# EAGLE design module_decoding_a (EAGLE 6.5.0)

## Sheet 1 of 13
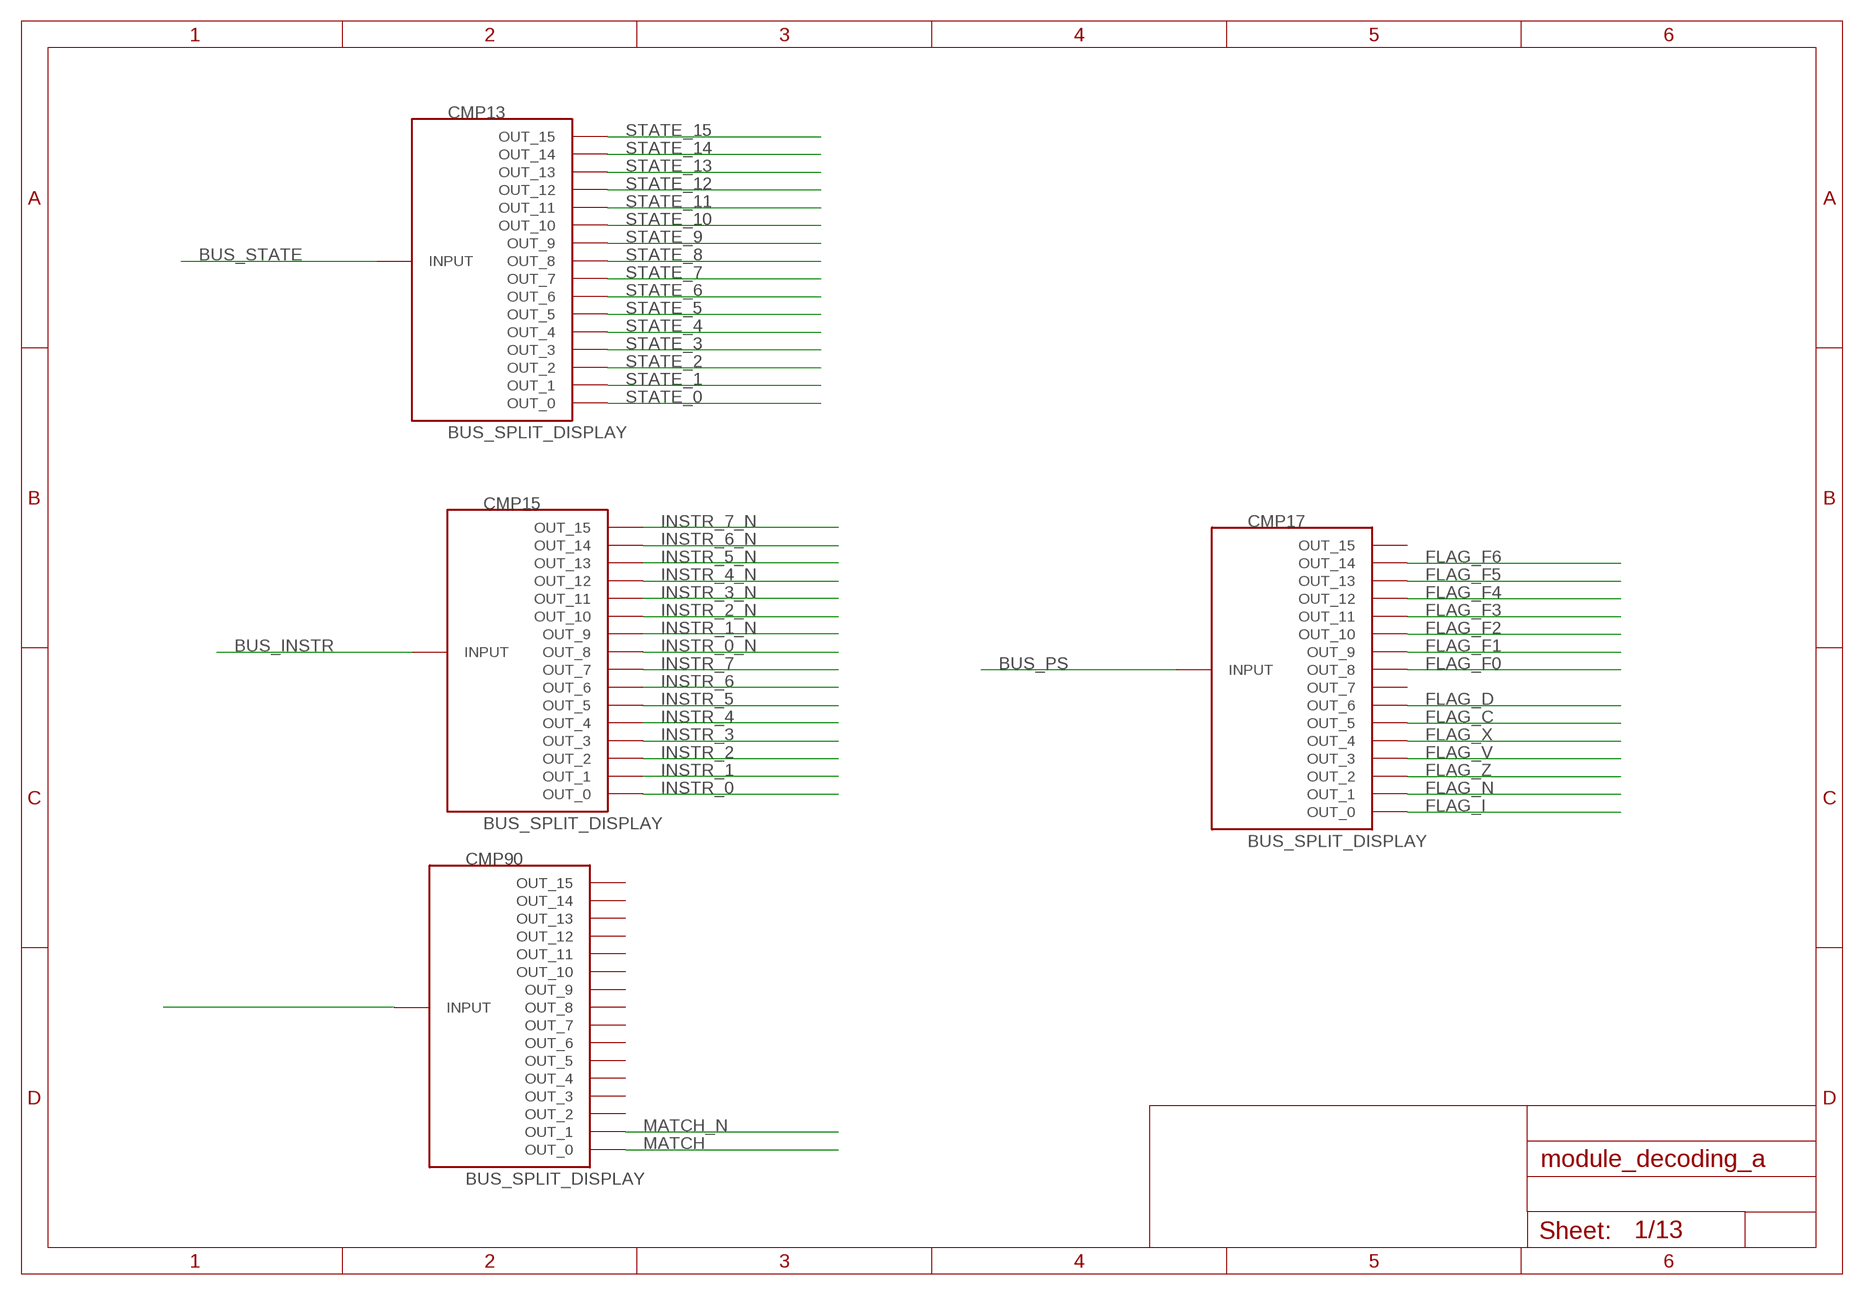
[diagram p0: schematic, sheet 1]

### Parts
CMP13  BUS_SPLIT_DISPLAY  [BUS_SPLIT_DISPLAY]
CMP15  BUS_SPLIT_DISPLAY  [BUS_SPLIT_DISPLAY]
CMP17  BUS_SPLIT_DISPLAY  [BUS_SPLIT_DISPLAY]
CMP90  BUS_SPLIT_DISPLAY  [BUS_SPLIT_DISPLAY]

### Nets
BUS_INSTR: CMP15.INPUT
BUS_PS: CMP17.INPUT
BUS_STATE: CMP13.INPUT
FLAG_C: CMP17.P$6(OUT_5)
FLAG_D: CMP17.P$7(OUT_6)
FLAG_F0: CMP17.P$9(OUT_8)
FLAG_F1: CMP17.P$10(OUT_9)
FLAG_F2: CMP17.P$11(OUT_10) ; also sheet 11
FLAG_F3: CMP17.P$12(OUT_11)
FLAG_F4: CMP17.P$13(OUT_12) ; also sheet 10
FLAG_F5: CMP17.P$14(OUT_13) ; also sheet 10
FLAG_F6: CMP17.P$15(OUT_14)
FLAG_I: CMP17.P$1(OUT_0)
FLAG_N: CMP17.P$2(OUT_1)
FLAG_V: CMP17.P$4(OUT_3)
FLAG_X: CMP17.P$5(OUT_4)
FLAG_Z: CMP17.P$3(OUT_2)
INSTR_0: CMP15.P$1(OUT_0) ; also sheet 13
INSTR_0_N: CMP15.P$9(OUT_8) ; also sheet 7
INSTR_1: CMP15.P$2(OUT_1)
INSTR_1_N: CMP15.P$10(OUT_9)
INSTR_2: CMP15.P$3(OUT_2) ; also sheet 5,12
INSTR_2_N: CMP15.P$11(OUT_10) ; also sheet 7
INSTR_3: CMP15.P$4(OUT_3) ; also sheet 5
INSTR_3_N: CMP15.P$12(OUT_11)
INSTR_4: CMP15.P$5(OUT_4)
INSTR_4_N: CMP15.P$13(OUT_12)
INSTR_5: CMP15.P$6(OUT_5)
INSTR_5_N: CMP15.P$14(OUT_13)
INSTR_6: CMP15.P$7(OUT_6)
INSTR_6_N: CMP15.P$15(OUT_14)
INSTR_7: CMP15.P$8(OUT_7)
INSTR_7_N: CMP15.P$16(OUT_15)
MATCH: CMP90.P$1(OUT_0) ; also sheet 8
MATCH_N: CMP90.P$2(OUT_1) ; also sheet 8
N$27: CMP90.INPUT
STATE_0: CMP13.P$1(OUT_0) ; also sheet 6,7,8
STATE_1: CMP13.P$2(OUT_1) ; also sheet 7
STATE_2: CMP13.P$3(OUT_2) ; also sheet 6
STATE_3: CMP13.P$4(OUT_3)
STATE_4: CMP13.P$5(OUT_4)
STATE_5: CMP13.P$6(OUT_5)
STATE_6: CMP13.P$7(OUT_6) ; also sheet 7
STATE_7: CMP13.P$8(OUT_7) ; also sheet 6
STATE_8: CMP13.P$9(OUT_8)
STATE_9: CMP13.P$10(OUT_9)
STATE_10: CMP13.P$11(OUT_10)
STATE_11: CMP13.P$12(OUT_11)
STATE_12: CMP13.P$13(OUT_12)
STATE_13: CMP13.P$14(OUT_13)
STATE_14: CMP13.P$15(OUT_14)
STATE_15: CMP13.P$16(OUT_15) ; also sheet 7
Unconnected: CMP17.P$8(OUT_7) CMP17.P$16(OUT_15) CMP90.P$3(OUT_2) CMP90.P$4(OUT_3) CMP90.P$5(OUT_4) CMP90.P$6(OUT_5) CMP90.P$7(OUT_6) CMP90.P$8(OUT_7) CMP90.P$9(OUT_8) CMP90.P$10(OUT_9) CMP90.P$11(OUT_10) CMP90.P$12(OUT_11) CMP90.P$13(OUT_12) CMP90.P$14(OUT_13) CMP90.P$15(OUT_14) CMP90.P$16(OUT_15)

## Sheet 2 of 13
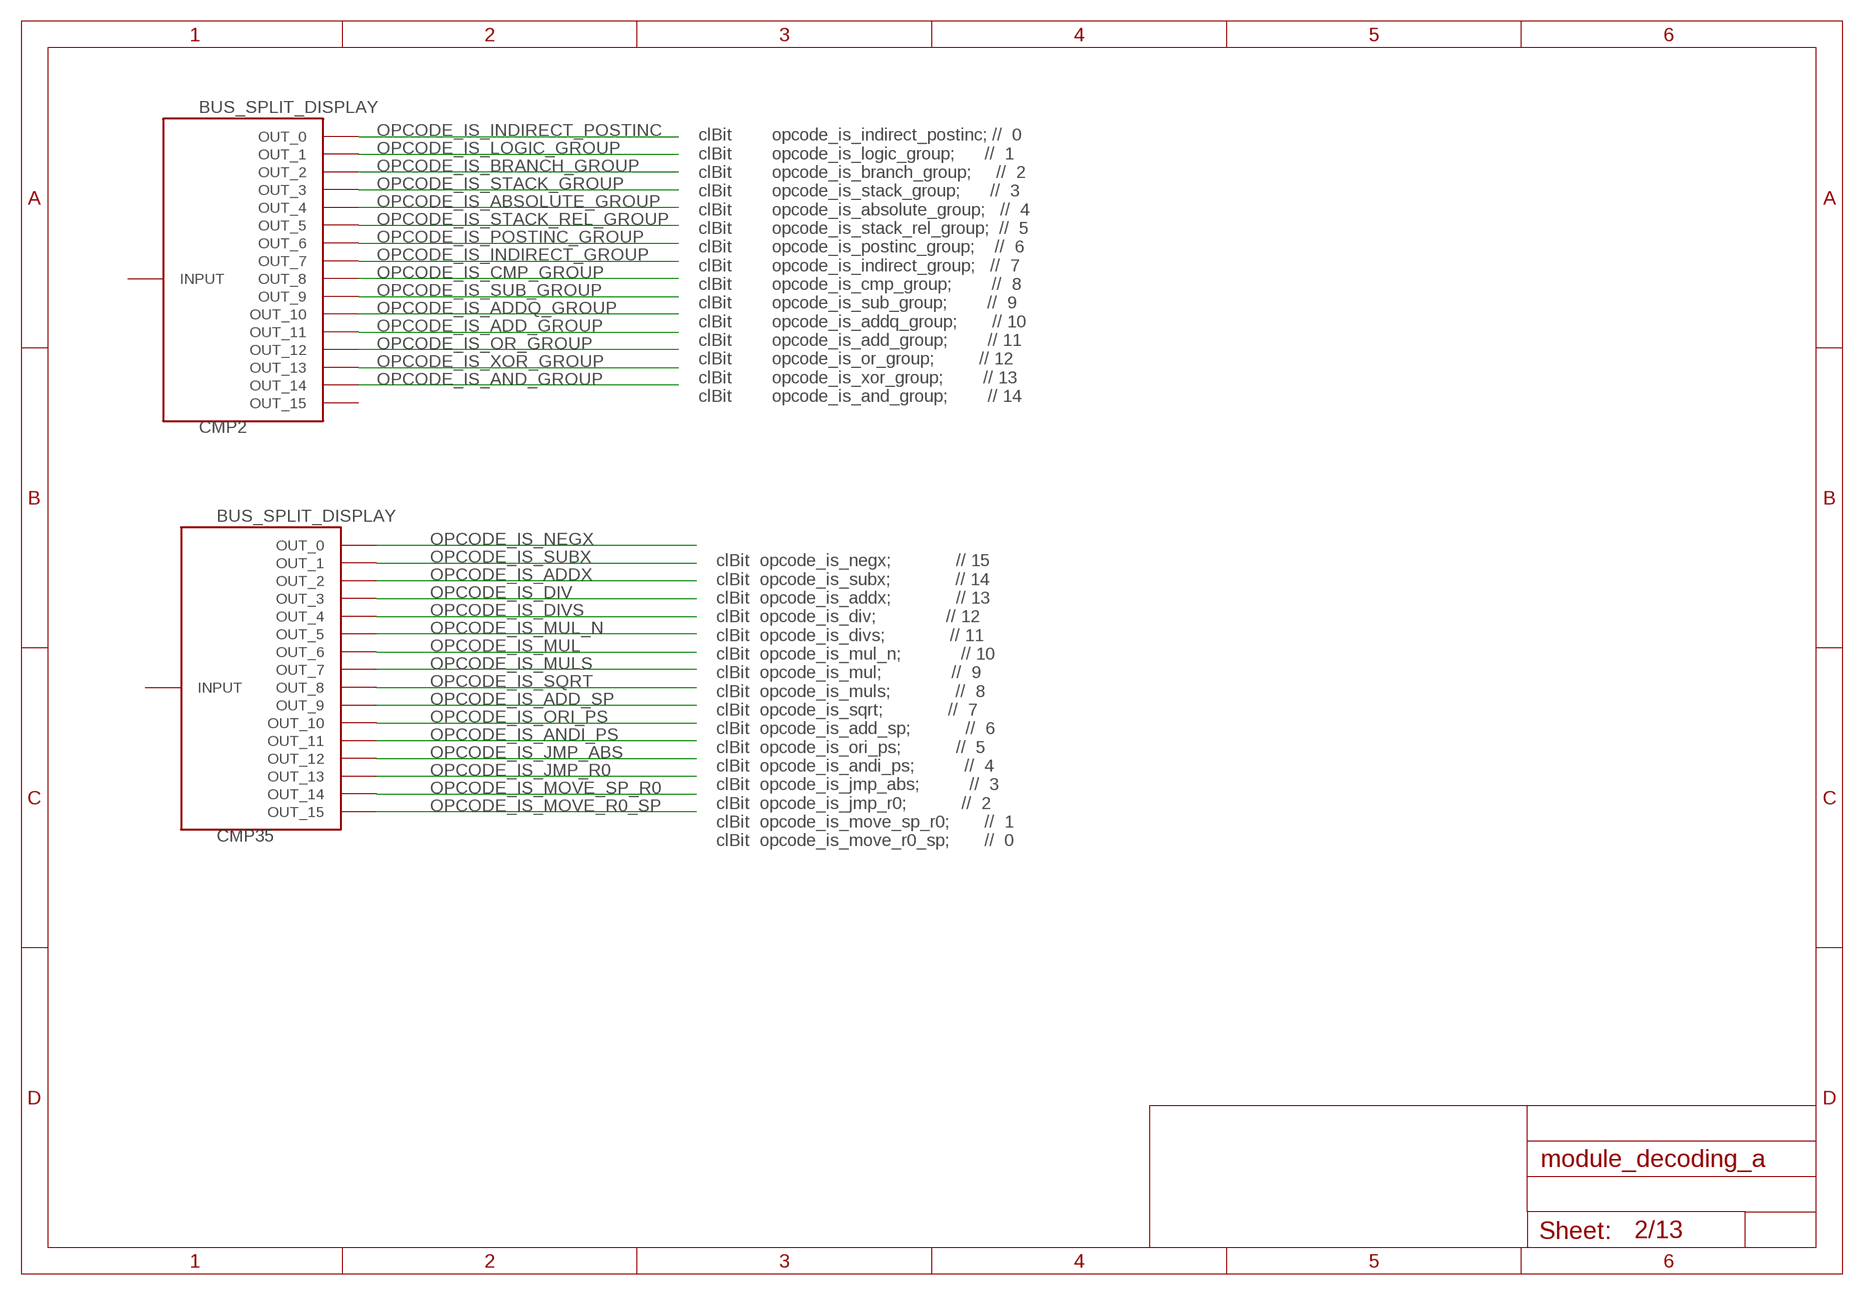
[diagram p1: schematic, sheet 2]

### Parts
CMP2  BUS_SPLIT_DISPLAY  [BUS_SPLIT_DISPLAY]
CMP35  BUS_SPLIT_DISPLAY  [BUS_SPLIT_DISPLAY]

### Nets
OPCODE_IS_ABSOLUTE_GROUP: CMP2.P$5(OUT_4) ; also sheet 7,12,13
OPCODE_IS_ADD_GROUP: CMP2.P$12(OUT_11)
OPCODE_IS_ADD_SP: CMP35.P$10(OUT_9) ; also sheet 6,12,13
OPCODE_IS_ADDQ_GROUP: CMP2.P$11(OUT_10)
OPCODE_IS_ADDX: CMP35.P$3(OUT_2)
OPCODE_IS_AND_GROUP: CMP2.P$15(OUT_14)
OPCODE_IS_ANDI_PS: CMP35.P$12(OUT_11) ; also sheet 8,9
OPCODE_IS_BRANCH_GROUP: CMP2.P$3(OUT_2) ; also sheet 6,8,12,13
OPCODE_IS_CMP_GROUP: CMP2.P$9(OUT_8)
OPCODE_IS_DIV: CMP35.P$4(OUT_3) ; also sheet 6
OPCODE_IS_DIVS: CMP35.P$5(OUT_4)
OPCODE_IS_INDIRECT_GROUP: CMP2.P$8(OUT_7)
OPCODE_IS_INDIRECT_POSTINC: CMP2.P$1(OUT_0) ; also sheet 12
OPCODE_IS_JMP_ABS: CMP35.P$13(OUT_12) ; also sheet 12,13
OPCODE_IS_JMP_R0: CMP35.P$14(OUT_13) ; also sheet 12,13
OPCODE_IS_LOGIC_GROUP: CMP2.P$2(OUT_1)
OPCODE_IS_MOVE_R0_SP: CMP35.P$16(OUT_15) ; also sheet 8
OPCODE_IS_MOVE_SP_R0: CMP35.P$15(OUT_14) ; also sheet 8,12
OPCODE_IS_MUL: CMP35.P$7(OUT_6) ; also sheet 13
OPCODE_IS_MUL_N: CMP35.P$6(OUT_5)
OPCODE_IS_MULS: CMP35.P$8(OUT_7)
OPCODE_IS_NEGX: CMP35.P$1(OUT_0)
OPCODE_IS_OR_GROUP: CMP2.P$13(OUT_12)
OPCODE_IS_ORI_PS: CMP35.P$11(OUT_10) ; also sheet 8,9
OPCODE_IS_POSTINC_GROUP: CMP2.P$7(OUT_6)
OPCODE_IS_SQRT: CMP35.P$9(OUT_8) ; also sheet 13
OPCODE_IS_STACK_GROUP: CMP2.P$4(OUT_3) ; also sheet 12
OPCODE_IS_STACK_REL_GROUP: CMP2.P$6(OUT_5) ; also sheet 6,12,13
OPCODE_IS_SUB_GROUP: CMP2.P$10(OUT_9)
OPCODE_IS_SUBX: CMP35.P$2(OUT_1)
OPCODE_IS_XOR_GROUP: CMP2.P$14(OUT_13)
Unconnected: CMP2.INPUT CMP2.P$16(OUT_15) CMP35.INPUT

### Notes on the sheet
- clBit        opcode_is_indirect_postinc; //  0
      clBit        opcode_is_logic_group;      //  1
      clBit        opcode_is_branch_group;     //  2
      clBit        opcode_is_stack_group;      //  3
      clBit        opcode_is_absolute_group;   //  4
      clBit        opcode_is_stack_rel_group;  //  5
      clBit        opcode_is_postinc_group;    //  6
      clBit        opcode_is_indirect_group;   //  7
      clBit        opcode_is_cmp_group;        //  8
      clBit        opcode_is_sub_group;        //  9
      clBit        opcode_is_addq_group;       // 10
      clBit        opcode_is_add_group;        // 11
      clBit        opcode_is_or_group;         // 12
      clBit        opcode_is_xor_group;        // 13
      clBit        opcode_is_and_group;        // 14
- clBit  opcode_is_negx;             // 15
      clBit  opcode_is_subx;             // 14
      clBit  opcode_is_addx;             // 13
      clBit  opcode_is_div;              // 12
      clBit  opcode_is_divs;             // 11
      clBit  opcode_is_mul_n;            // 10
      clBit  opcode_is_mul;              //  9
      clBit  opcode_is_muls;             //  8
      clBit  opcode_is_sqrt;             //  7
      clBit  opcode_is_add_sp;           //  6
      clBit  opcode_is_ori_ps;           //  5
      clBit  opcode_is_andi_ps;          //  4
      clBit  opcode_is_jmp_abs;          //  3
      clBit  opcode_is_jmp_r0;           //  2
      clBit  opcode_is_move_sp_r0;       //  1
      clBit  opcode_is_move_r0_sp;       //  0

## Sheet 3 of 13
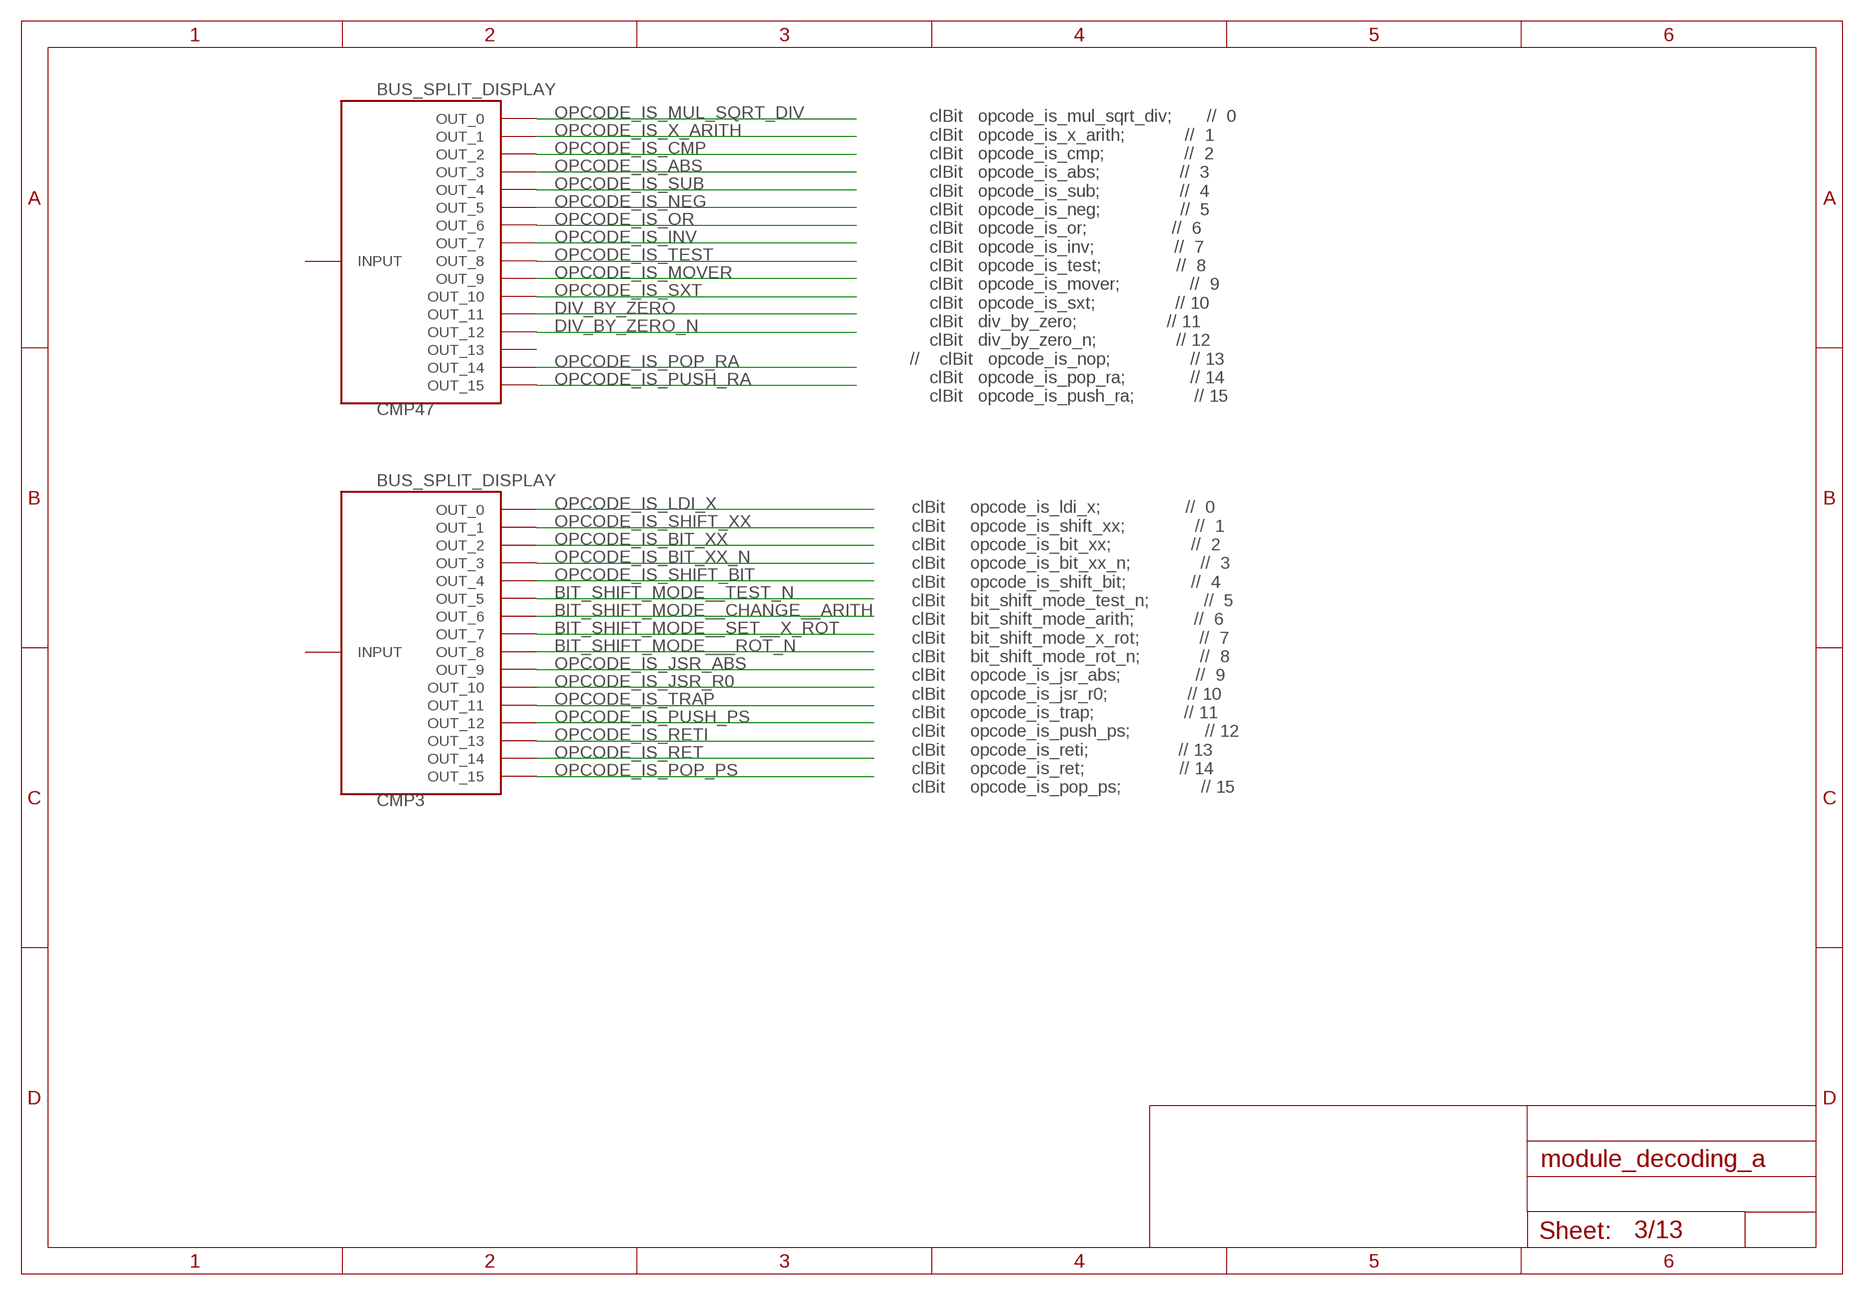
[diagram p2: schematic, sheet 3]

### Parts
CMP3  BUS_SPLIT_DISPLAY  [BUS_SPLIT_DISPLAY]
CMP47  BUS_SPLIT_DISPLAY  [BUS_SPLIT_DISPLAY]

### Nets
BIT_SHIFT_MODE___ROT_N: CMP3.P$9(OUT_8)
BIT_SHIFT_MODE__CHANGE__ARITH: CMP3.P$7(OUT_6)
BIT_SHIFT_MODE__SET__X_ROT: CMP3.P$8(OUT_7)
BIT_SHIFT_MODE__TEST_N: CMP3.P$6(OUT_5)
DIV_BY_ZERO: CMP47.P$12(OUT_11) ; also sheet 10,13
DIV_BY_ZERO_N: CMP47.P$13(OUT_12)
OPCODE_IS_ABS: CMP47.P$4(OUT_3)
OPCODE_IS_BIT_XX: CMP3.P$3(OUT_2) ; also sheet 13
OPCODE_IS_BIT_XX_N: CMP3.P$4(OUT_3)
OPCODE_IS_CMP: CMP47.P$3(OUT_2)
OPCODE_IS_INV: CMP47.P$8(OUT_7)
OPCODE_IS_JSR_ABS: CMP3.P$10(OUT_9) ; also sheet 12,13
OPCODE_IS_JSR_R0: CMP3.P$11(OUT_10) ; also sheet 7,12
OPCODE_IS_LDI_X: CMP3.P$1(OUT_0) ; also sheet 7,9
OPCODE_IS_MOVER: CMP47.P$10(OUT_9)
OPCODE_IS_MUL_SQRT_DIV: CMP47.P$1(OUT_0) ; also sheet 12
OPCODE_IS_NEG: CMP47.P$6(OUT_5)
OPCODE_IS_OR: CMP47.P$7(OUT_6)
OPCODE_IS_POP_PS: CMP3.P$16(OUT_15) ; also sheet 8
OPCODE_IS_POP_RA: CMP47.P$15(OUT_14) ; also sheet 8
OPCODE_IS_PUSH_PS: CMP3.P$13(OUT_12) ; also sheet 12
OPCODE_IS_PUSH_RA: CMP47.P$16(OUT_15) ; also sheet 12
OPCODE_IS_RET: CMP3.P$15(OUT_14) ; also sheet 8,13
OPCODE_IS_RETI: CMP3.P$14(OUT_13) ; also sheet 8,13
OPCODE_IS_SHIFT_BIT: CMP3.P$5(OUT_4) ; also sheet 12
OPCODE_IS_SHIFT_XX: CMP3.P$2(OUT_1) ; also sheet 9,12,13
OPCODE_IS_SUB: CMP47.P$5(OUT_4)
OPCODE_IS_SXT: CMP47.P$11(OUT_10)
OPCODE_IS_TEST: CMP47.P$9(OUT_8)
OPCODE_IS_TRAP: CMP3.P$12(OUT_11) ; also sheet 12,13
OPCODE_IS_X_ARITH: CMP47.P$2(OUT_1)
Unconnected: CMP3.INPUT CMP47.INPUT CMP47.P$14(OUT_13)

### Notes on the sheet
- clBit   opcode_is_mul_sqrt_div;       //  0
      clBit   opcode_is_x_arith;            //  1
      clBit   opcode_is_cmp;                //  2
      clBit   opcode_is_abs;                //  3
      clBit   opcode_is_sub;                //  4
      clBit   opcode_is_neg;                //  5
      clBit   opcode_is_or;                 //  6
      clBit   opcode_is_inv;                //  7
      clBit   opcode_is_test;               //  8
      clBit   opcode_is_mover;              //  9
      clBit   opcode_is_sxt;                // 10
      clBit   div_by_zero;                  // 11
      clBit   div_by_zero_n;                // 12
  //    clBit   opcode_is_nop;                // 13
      clBit   opcode_is_pop_ra;             // 14
      clBit   opcode_is_push_ra;            // 15
- clBit     opcode_is_ldi_x;                 //  0
      clBit     opcode_is_shift_xx;              //  1
      clBit     opcode_is_bit_xx;                //  2
      clBit     opcode_is_bit_xx_n;              //  3
      clBit     opcode_is_shift_bit;             //  4
      clBit     bit_shift_mode_test_n;           //  5
      clBit     bit_shift_mode_arith;            //  6
      clBit     bit_shift_mode_x_rot;            //  7
      clBit     bit_shift_mode_rot_n;            //  8
      clBit     opcode_is_jsr_abs;               //  9
      clBit     opcode_is_jsr_r0;                // 10
      clBit     opcode_is_trap;                  // 11
      clBit     opcode_is_push_ps;               // 12
      clBit     opcode_is_reti;                  // 13
      clBit     opcode_is_ret;                   // 14
      clBit     opcode_is_pop_ps;                // 15

## Sheet 4 of 13
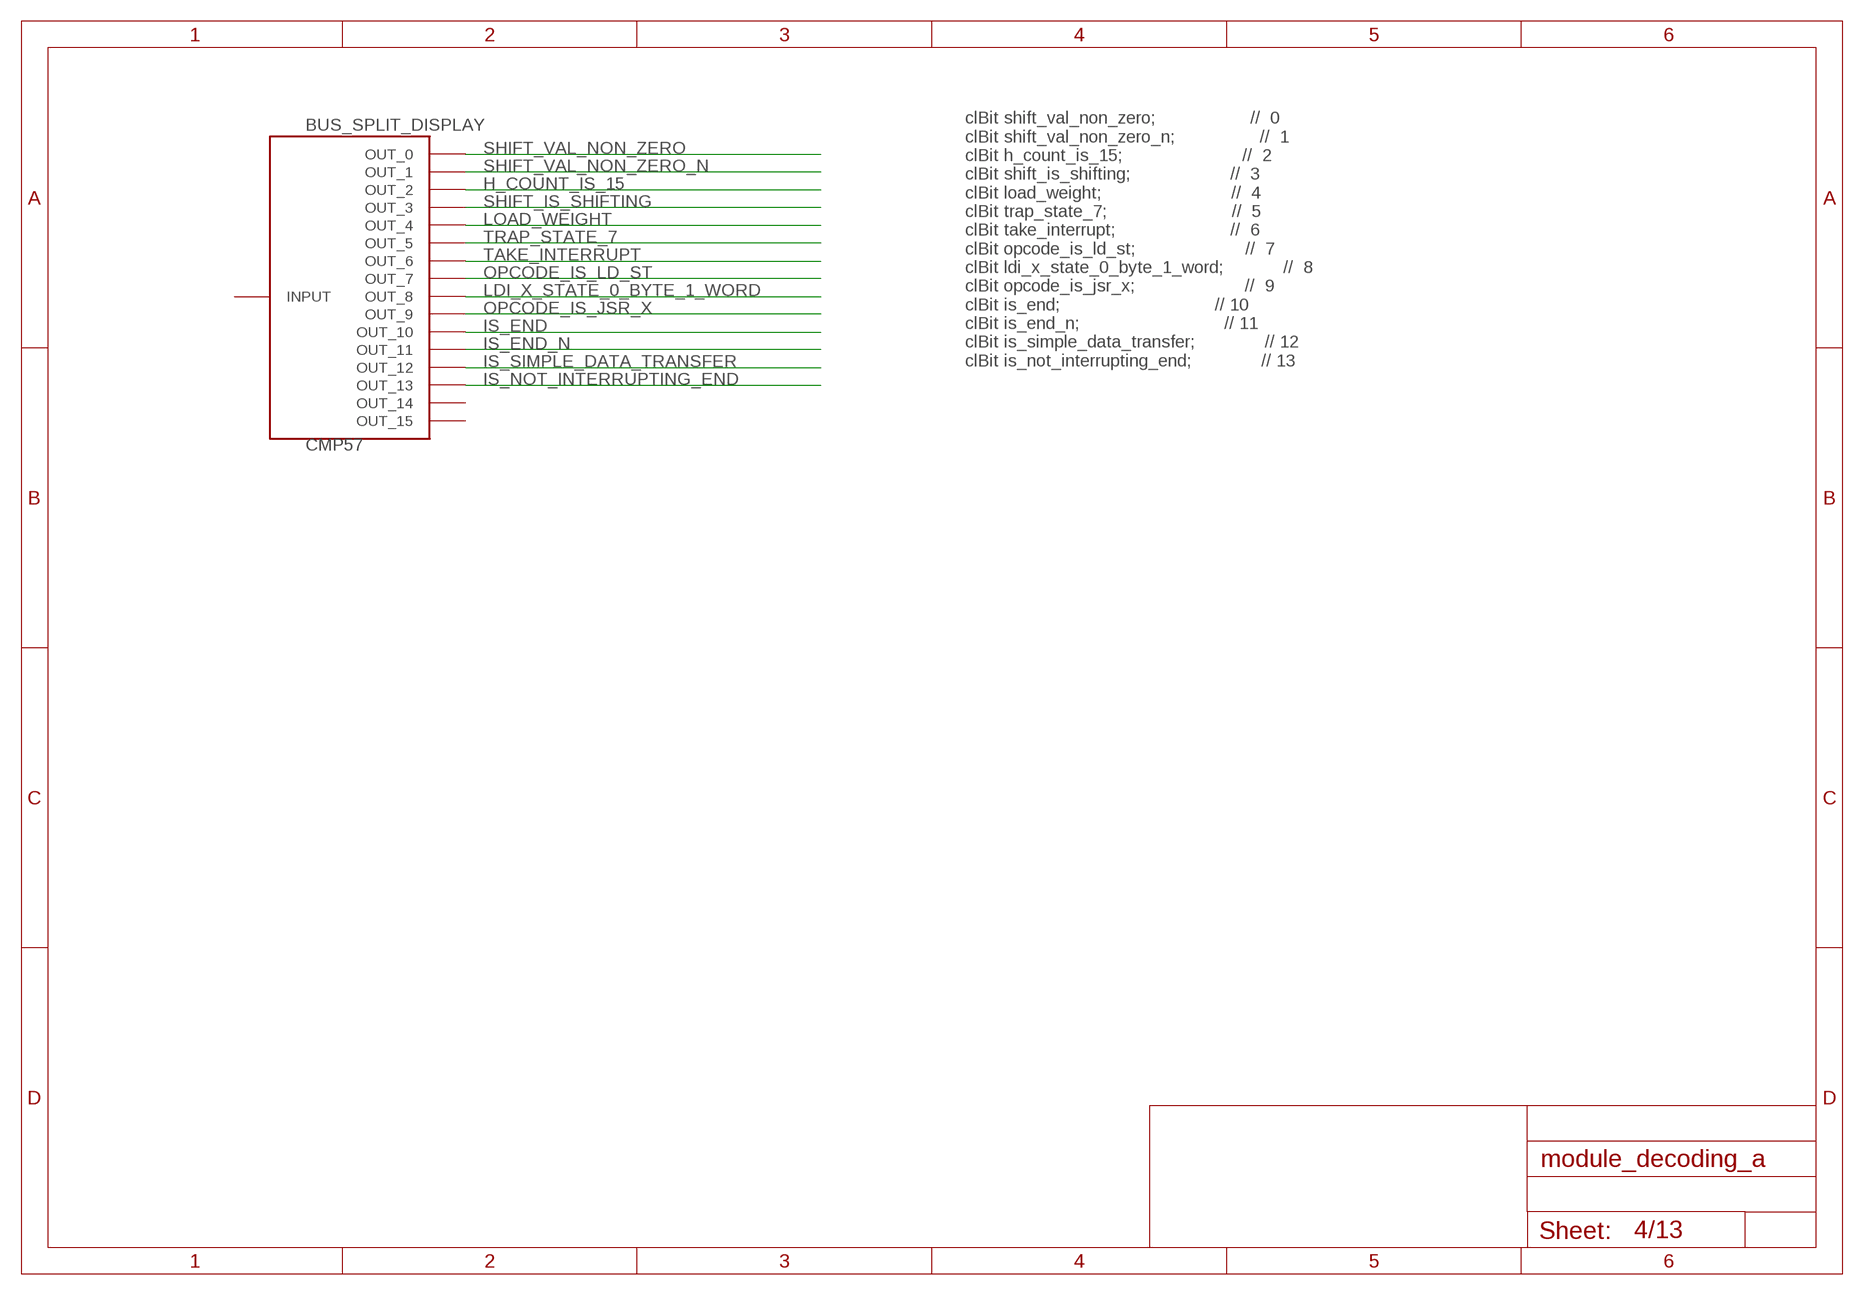
[diagram p3: schematic, sheet 4]

### Parts
CMP57  BUS_SPLIT_DISPLAY  [BUS_SPLIT_DISPLAY]

### Nets
H_COUNT_IS_15: CMP57.P$3(OUT_2) ; also sheet 7,13
IS_END: CMP57.P$11(OUT_10) ; also sheet 12,13
IS_END_N: CMP57.P$12(OUT_11)
IS_NOT_INTERRUPTING_END: CMP57.P$14(OUT_13) ; also sheet 12
IS_SIMPLE_DATA_TRANSFER: CMP57.P$13(OUT_12) ; also sheet 7
LDI_X_STATE_0_BYTE_1_WORD: CMP57.P$9(OUT_8) ; also sheet 13
LOAD_WEIGHT: CMP57.P$5(OUT_4)
OPCODE_IS_JSR_X: CMP57.P$10(OUT_9) ; also sheet 6
OPCODE_IS_LD_ST: CMP57.P$8(OUT_7)
SHIFT_IS_SHIFTING: CMP57.P$4(OUT_3) ; also sheet 13
SHIFT_VAL_NON_ZERO: CMP57.P$1(OUT_0)
SHIFT_VAL_NON_ZERO_N: CMP57.P$2(OUT_1) ; also sheet 9
TAKE_INTERRUPT: CMP57.P$7(OUT_6) ; also sheet 10
TRAP_STATE_7: CMP57.P$6(OUT_5) ; also sheet 13
Unconnected: CMP57.INPUT CMP57.P$15(OUT_14) CMP57.P$16(OUT_15)

### Notes on the sheet
- clBit shift_val_non_zero;                   //  0
      clBit shift_val_non_zero_n;                 //  1
      clBit h_count_is_15;                        //  2
      clBit shift_is_shifting;                    //  3
      clBit load_weight;                          //  4
      clBit trap_state_7;                         //  5
      clBit take_interrupt;                       //  6
      clBit opcode_is_ld_st;                      //  7
      clBit ldi_x_state_0_byte_1_word;            //  8
      clBit opcode_is_jsr_x;                      //  9
      clBit is_end;                               // 10
      clBit is_end_n;                             // 11
      clBit is_simple_data_transfer;              // 12
      clBit is_not_interrupting_end;              // 13

## Sheet 5 of 13
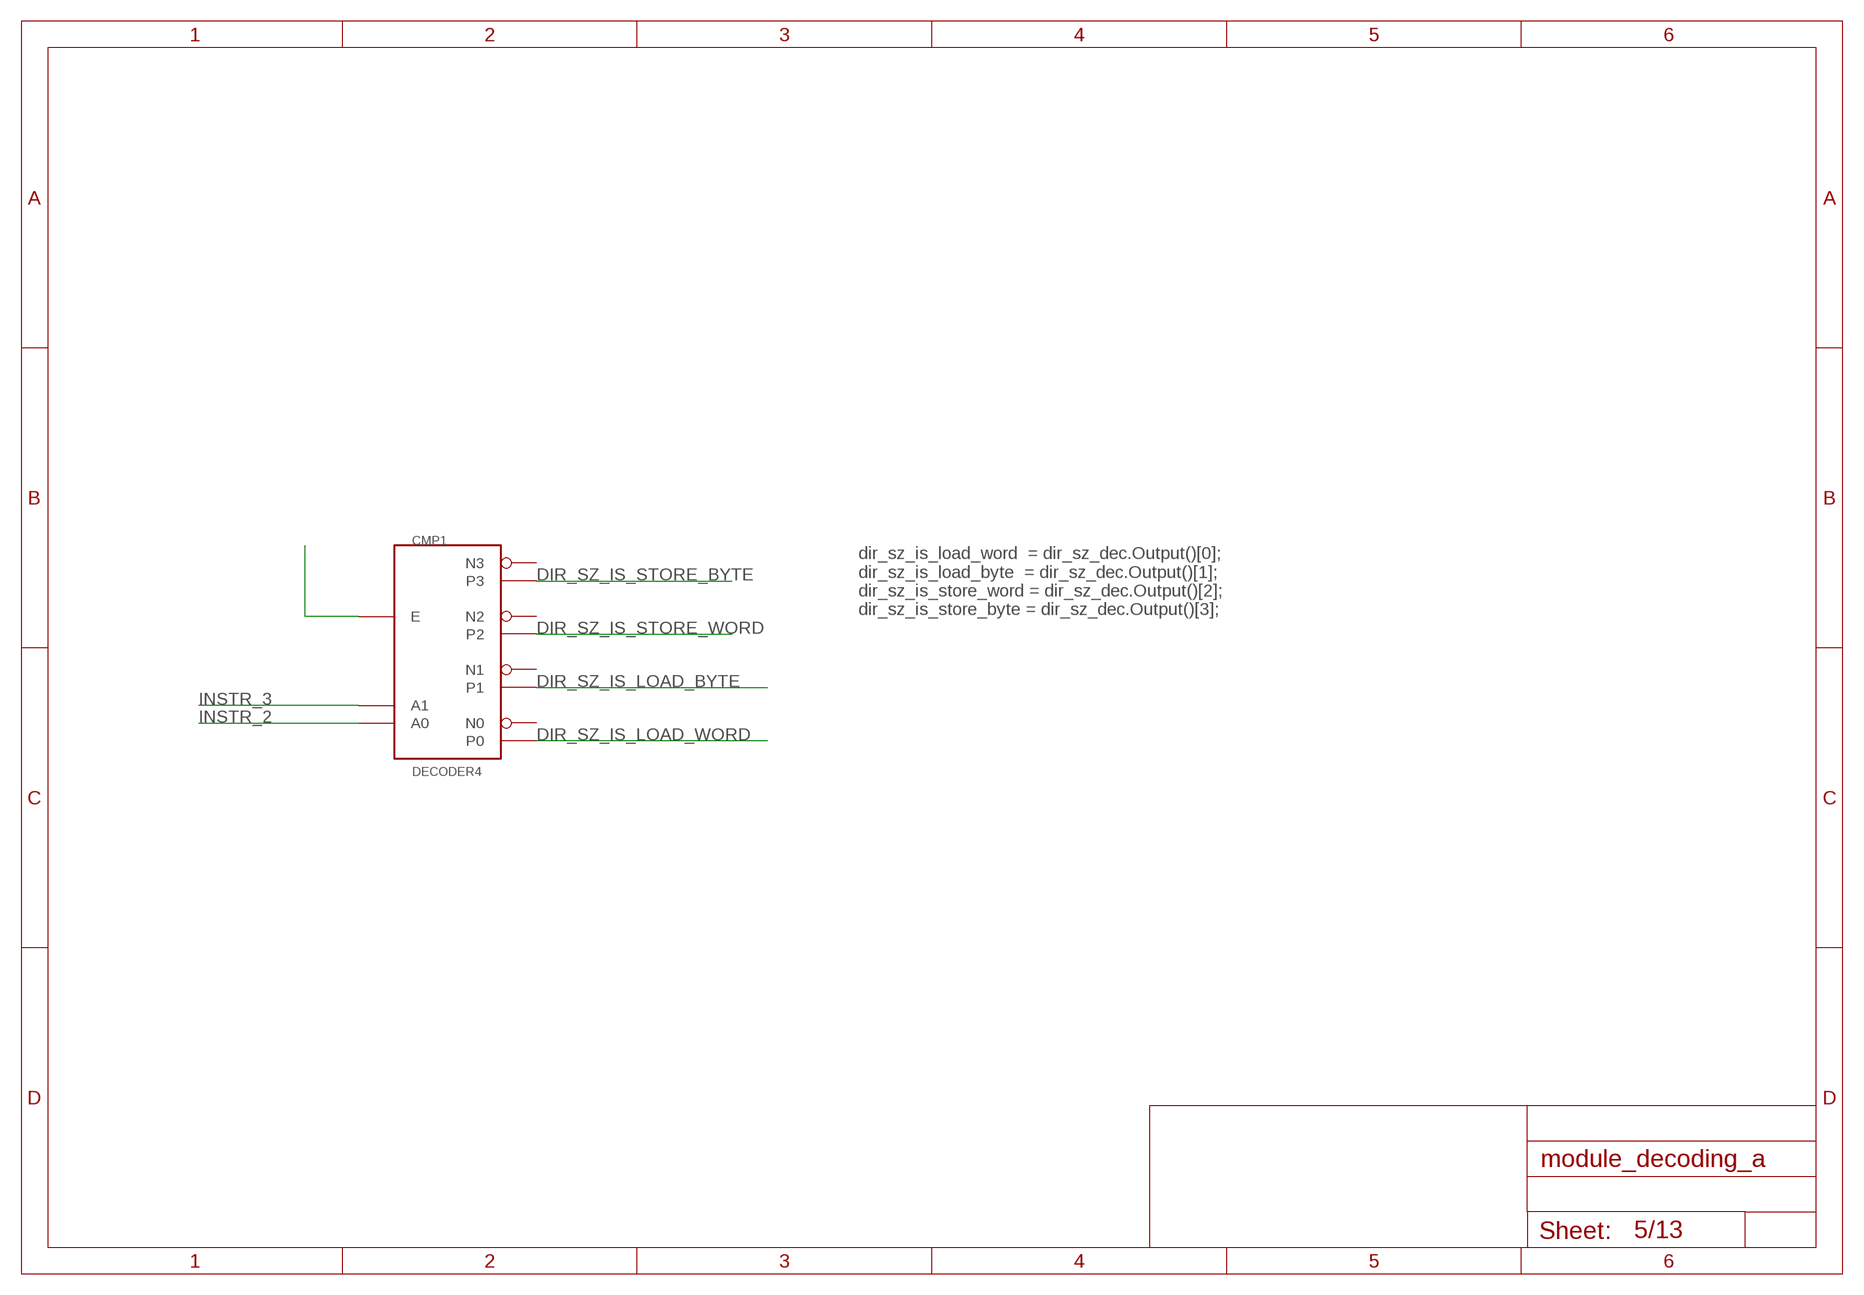
[diagram p4: schematic, sheet 5]

### Parts
CMP1  DECODER4  [DECODER4]

### Nets
DIR_SZ_IS_LOAD_BYTE: CMP1.P1 ; also sheet 13
DIR_SZ_IS_LOAD_WORD: CMP1.P0 ; also sheet 13
DIR_SZ_IS_STORE_BYTE: CMP1.P3 ; also sheet 7
DIR_SZ_IS_STORE_WORD: CMP1.P2 ; also sheet 7
INSTR_2: CMP1.A0 ; also sheet 1,12
INSTR_3: CMP1.A1 ; also sheet 1
N$1: CMP1.E
Unconnected: CMP1.N0 CMP1.N1 CMP1.N2 CMP1.N3

### Notes on the sheet
- dir_sz_is_load_word  = dir_sz_dec.Output()[0];
      dir_sz_is_load_byte  = dir_sz_dec.Output()[1];
      dir_sz_is_store_word = dir_sz_dec.Output()[2];
      dir_sz_is_store_byte = dir_sz_dec.Output()[3];

## Sheet 6 of 13
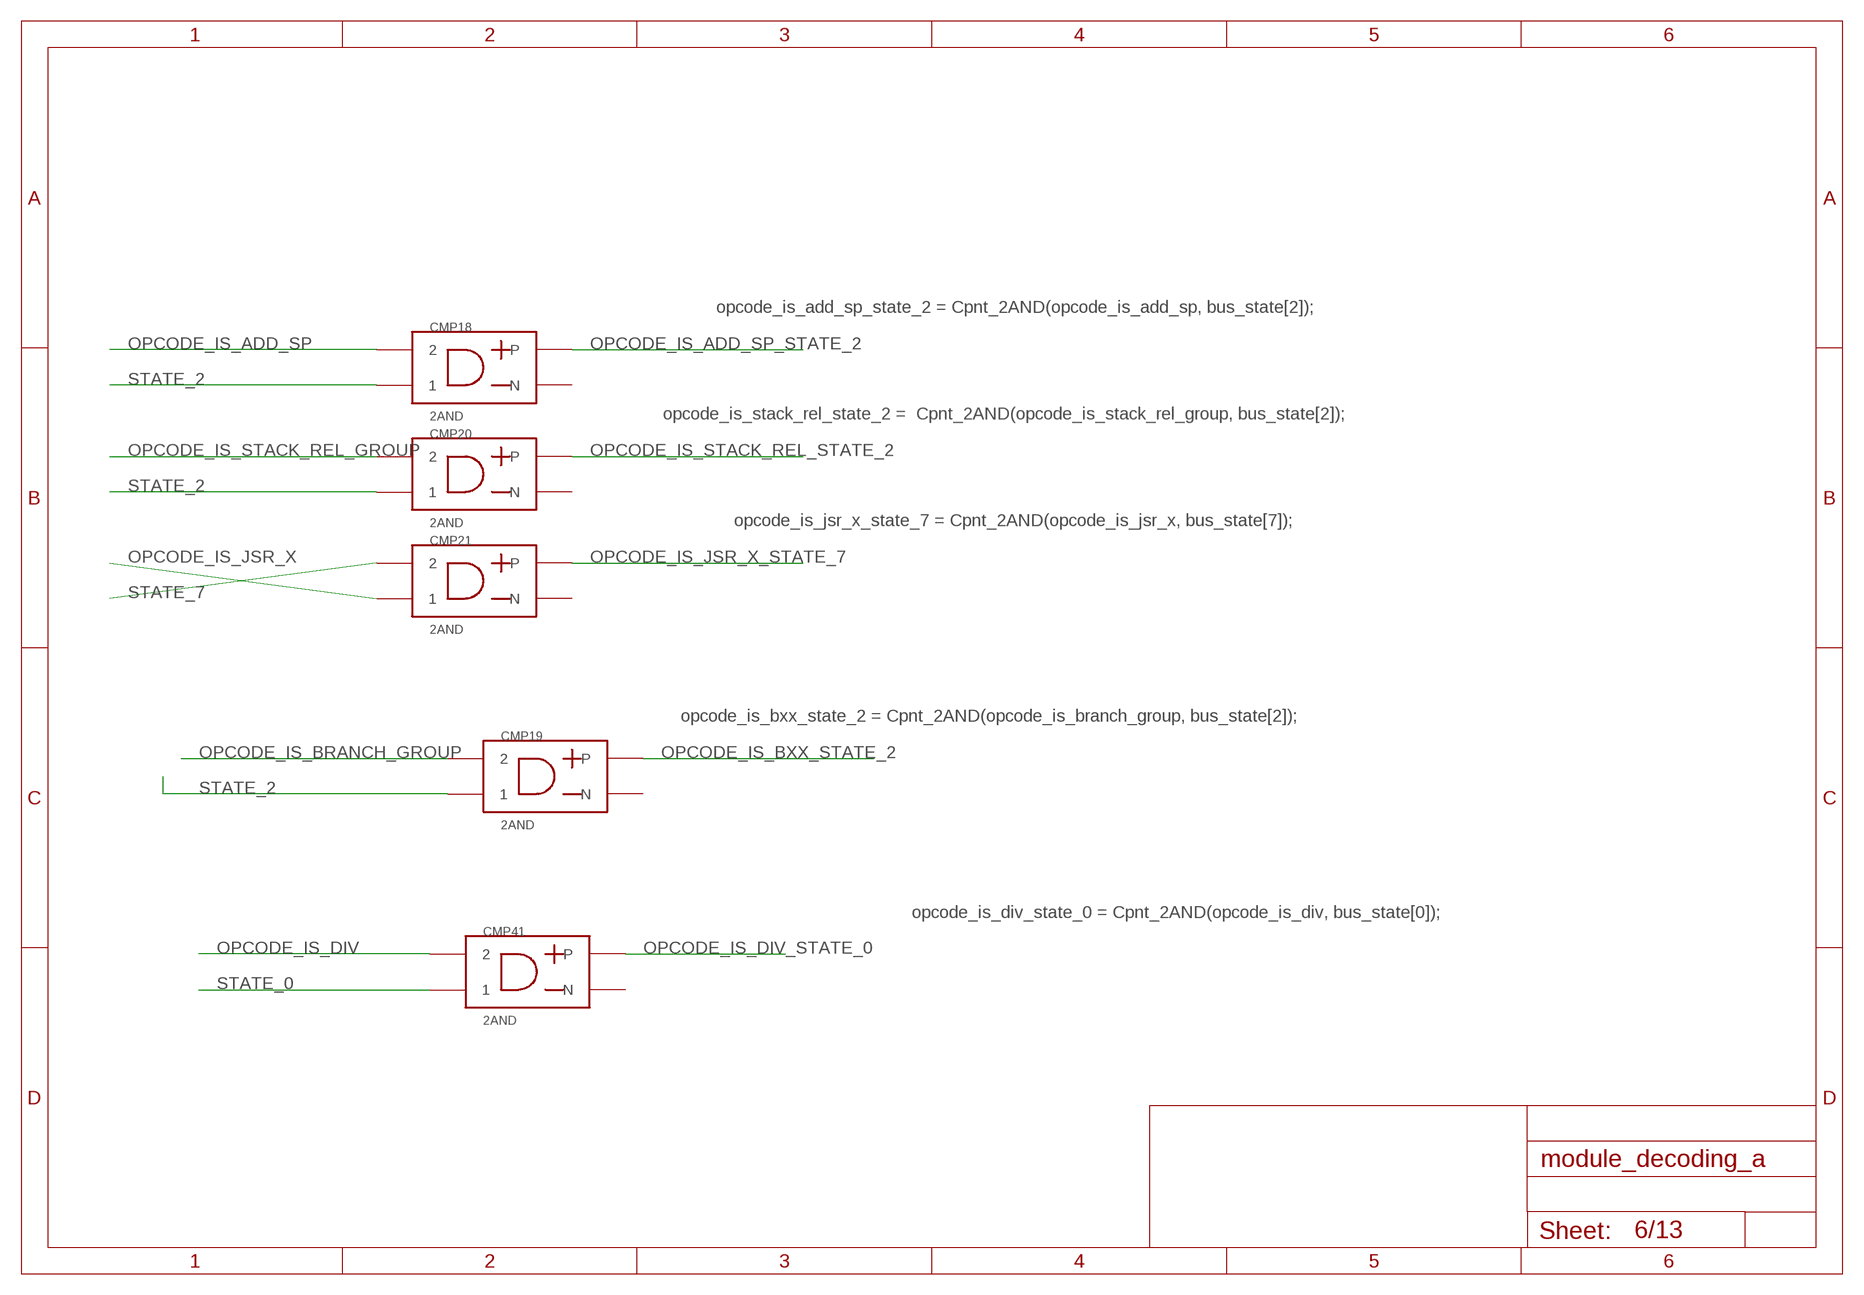
[diagram p5: schematic, sheet 6]

### Parts
CMP18  2AND  [2AND]
CMP19  2AND  [2AND]
CMP20  2AND  [2AND]
CMP21  2AND  [2AND]
CMP41  2AND  [2AND]

### Nets
OPCODE_IS_ADD_SP: CMP18.P$2 ; also sheet 2,12,13
OPCODE_IS_ADD_SP_STATE_2: CMP18.OUT_P(P) ; also sheet 13
OPCODE_IS_BRANCH_GROUP: CMP19.P$2 ; also sheet 2,8,12,13
OPCODE_IS_BXX_STATE_2: CMP19.OUT_P(P) ; also sheet 12
OPCODE_IS_DIV: CMP41.P$2 ; also sheet 2
OPCODE_IS_DIV_STATE_0: CMP41.OUT_P(P) ; also sheet 13
OPCODE_IS_JSR_X: CMP21.P$1 ; also sheet 4
OPCODE_IS_JSR_X_STATE_7: CMP21.OUT_P(P) ; also sheet 12,13
OPCODE_IS_STACK_REL_GROUP: CMP20.P$2 ; also sheet 2,12,13
OPCODE_IS_STACK_REL_STATE_2: CMP20.OUT_P(P) ; also sheet 7,12
STATE_0: CMP41.P$1 ; also sheet 1,7,8
STATE_2: CMP18.P$1 CMP19.P$1 CMP20.P$1 ; also sheet 1
STATE_7: CMP21.P$2 ; also sheet 1
Unconnected: CMP18.OUT_M(N) CMP19.OUT_M(N) CMP20.OUT_M(N) CMP21.OUT_M(N) CMP41.OUT_M(N)

### Notes on the sheet
- opcode_is_add_sp_state_2 = Cpnt_2AND(opcode_is_add_sp, bus_state[2]);
- opcode_is_stack_rel_state_2 =  Cpnt_2AND(opcode_is_stack_rel_group, bus_state[2]);
- opcode_is_jsr_x_state_7 = Cpnt_2AND(opcode_is_jsr_x, bus_state[7]);
- opcode_is_bxx_state_2 = Cpnt_2AND(opcode_is_branch_group, bus_state[2]);
- opcode_is_div_state_0 = Cpnt_2AND(opcode_is_div, bus_state[0]);

## Sheet 7 of 13
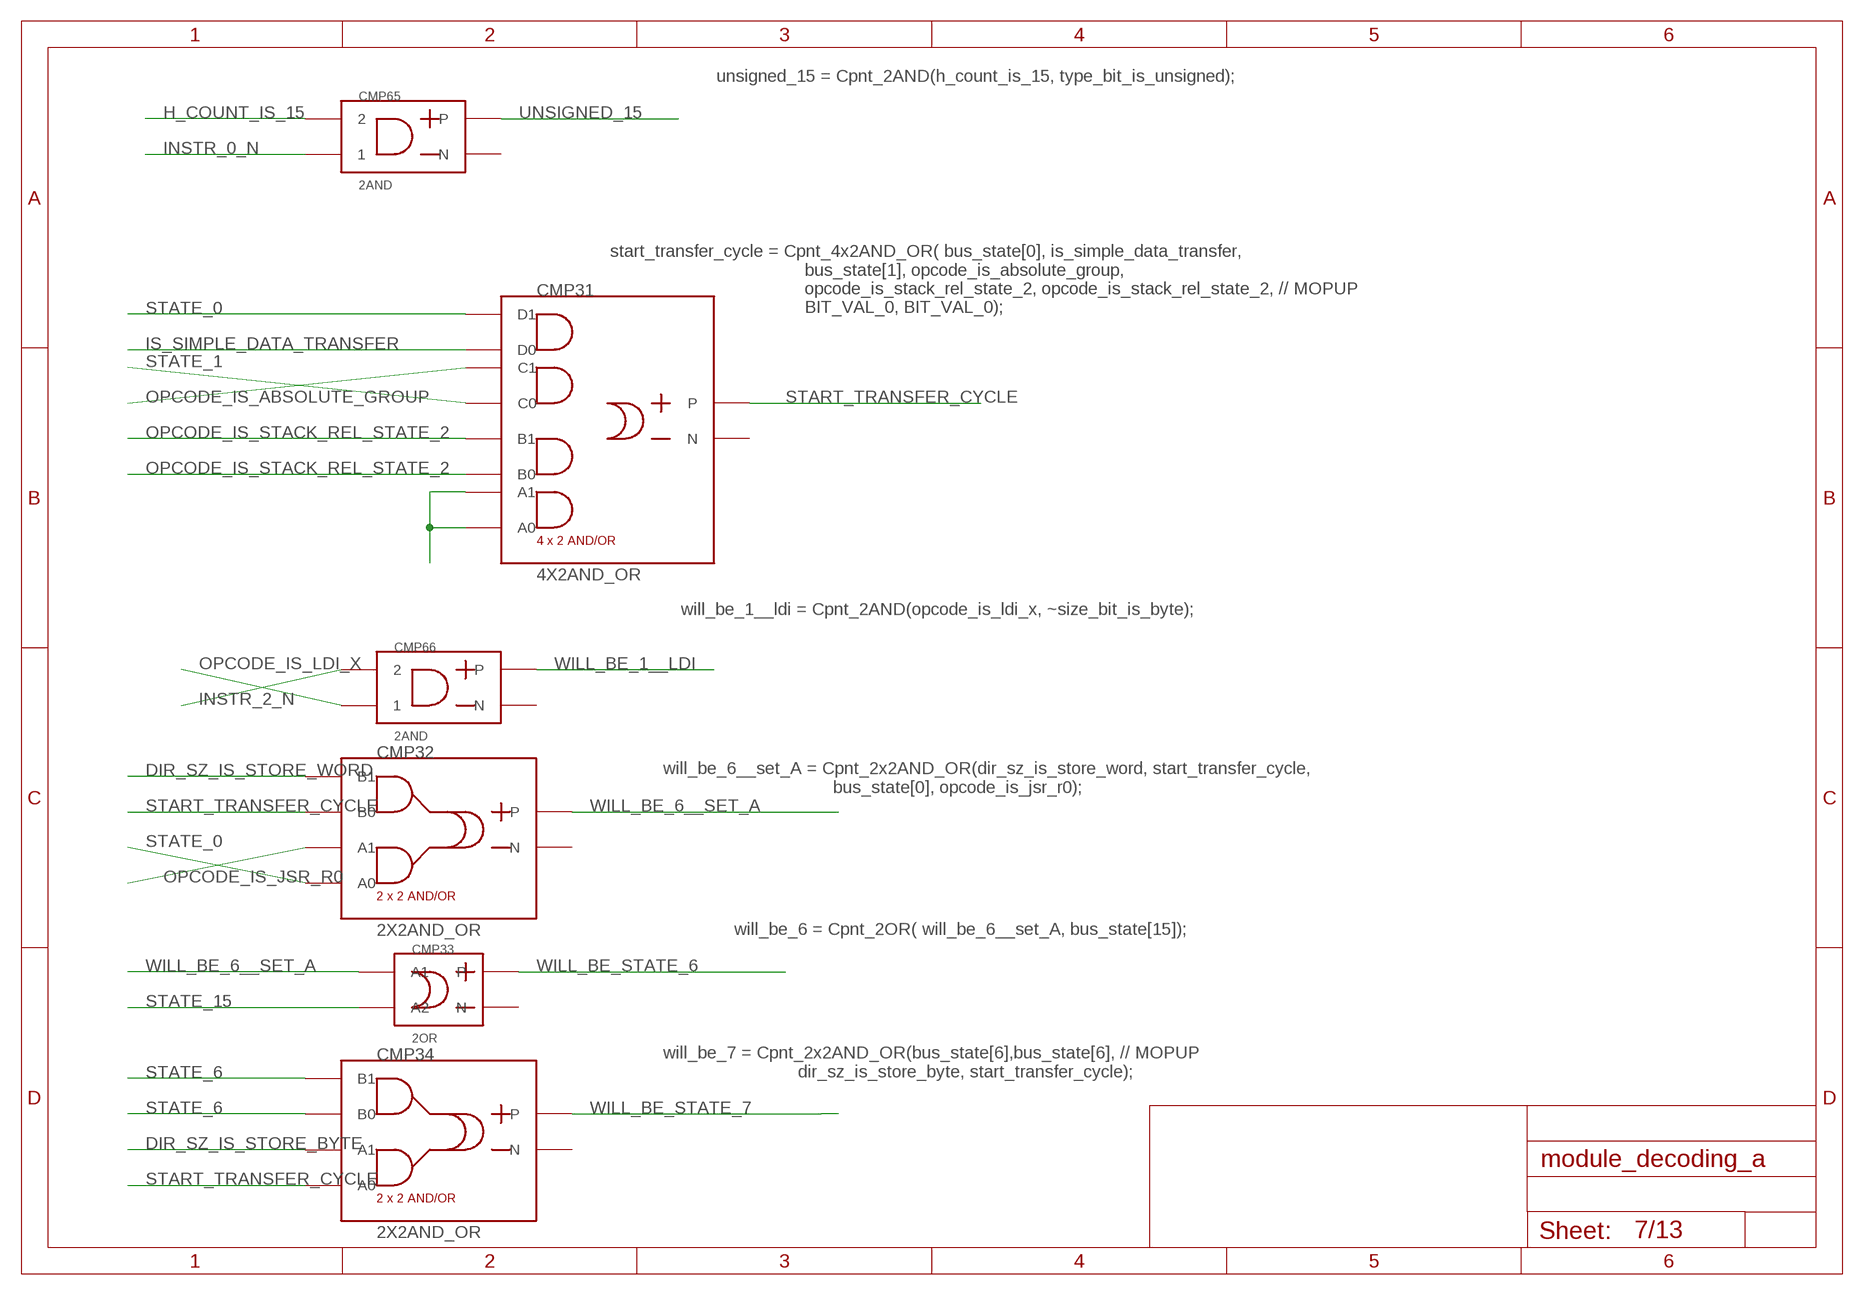
[diagram p6: schematic, sheet 7]

### Parts
CMP31  4X2AND_OR  [4X2AND_OR]
CMP32  2X2AND_OR  [2X2AND_OR]
CMP33  2OR  [2OR]
CMP34  2X2AND_OR  [2X2AND_OR]
CMP65  2AND  [2AND]
CMP66  2AND  [2AND]

### Nets
DIR_SZ_IS_STORE_BYTE: CMP34.P$2(A1) ; also sheet 5
DIR_SZ_IS_STORE_WORD: CMP32.P$4(B1) ; also sheet 5
H_COUNT_IS_15: CMP65.P$2 ; also sheet 4,13
INSTR_0_N: CMP65.P$1 ; also sheet 1
INSTR_2_N: CMP66.P$2 ; also sheet 1
IS_SIMPLE_DATA_TRANSFER: CMP31.P$7(D0) ; also sheet 4
N$4: CMP31.P$1(A0) CMP31.P$2(A1)
OPCODE_IS_ABSOLUTE_GROUP: CMP31.P$6(C1) ; also sheet 2,12,13
OPCODE_IS_JSR_R0: CMP32.P$2(A1) ; also sheet 3,12
OPCODE_IS_LDI_X: CMP66.P$1 ; also sheet 3,9
OPCODE_IS_STACK_REL_STATE_2: CMP31.P$3(B0) CMP31.P$4(B1) ; also sheet 6,12
START_TRANSFER_CYCLE: CMP31.OUT_P(P) CMP32.P$3(B0) CMP34.P$1(A0) ; also sheet 13
STATE_0: CMP31.P$8(D1) CMP32.P$1(A0) ; also sheet 1,6,8
STATE_1: CMP31.P$5(C0) ; also sheet 1
STATE_6: CMP34.P$3(B0) CMP34.P$4(B1) ; also sheet 1
STATE_15: CMP33.P$1(A2) ; also sheet 1
UNSIGNED_15: CMP65.OUT_P(P) ; also sheet 13
WILL_BE_1__LDI: CMP66.OUT_P(P) ; also sheet 13
WILL_BE_6__SET_A: CMP32.OUT_P(P) CMP33.P$2(A1)
WILL_BE_STATE_6: CMP33.OUT_P(P) ; also sheet 12,13
WILL_BE_STATE_7: CMP34.OUT_P(P) ; also sheet 12,13
Unconnected: CMP31.OUT_M(N) CMP32.OUT_M(N) CMP33.OUT_M(N) CMP34.OUT_M(N) CMP65.OUT_M(N) CMP66.OUT_M(N)

### Notes on the sheet
- unsigned_15 = Cpnt_2AND(h_count_is_15, type_bit_is_unsigned);
- start_transfer_cycle = Cpnt_4x2AND_OR( bus_state[0], is_simple_data_transfer,
                                             bus_state[1], opcode_is_absolute_group,
                                             opcode_is_stack_rel_state_2, opcode_is_stack_rel_state_2, // MOPUP
                                             BIT_VAL_0, BIT_VAL_0);
- will_be_1__ldi = Cpnt_2AND(opcode_is_ldi_x, ~size_bit_is_byte);
- will_be_6__set_A = Cpnt_2x2AND_OR(dir_sz_is_store_word, start_transfer_cycle,
                                        bus_state[0], opcode_is_jsr_r0);
- will_be_6 = Cpnt_2OR( will_be_6__set_A, bus_state[15]);
- will_be_7 = Cpnt_2x2AND_OR(bus_state[6],bus_state[6], // MOPUP
                                 dir_sz_is_store_byte, start_transfer_cycle);

## Sheet 8 of 13
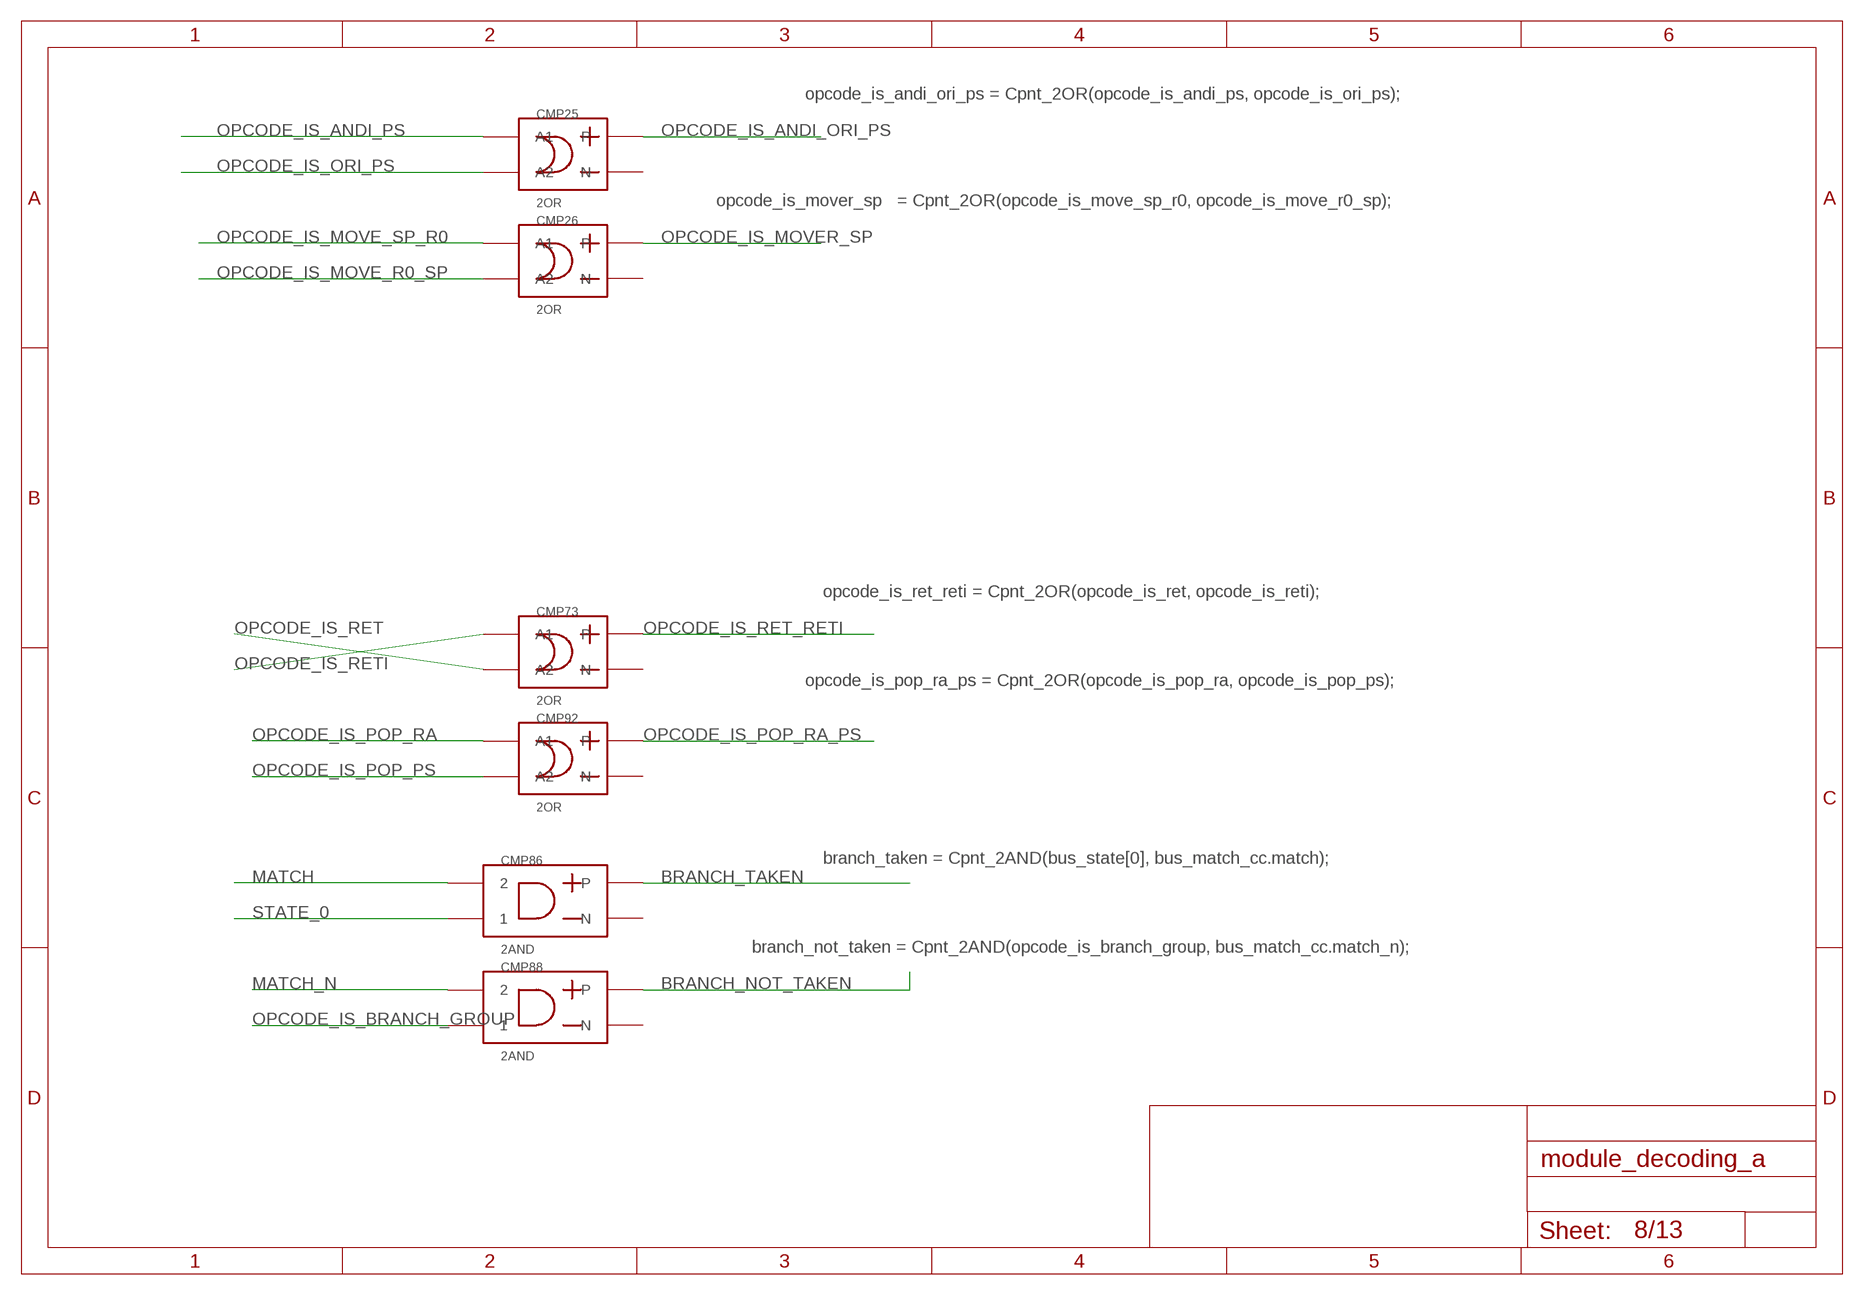
[diagram p7: schematic, sheet 8]

### Parts
CMP25  2OR  [2OR]
CMP26  2OR  [2OR]
CMP73  2OR  [2OR]
CMP86  2AND  [2AND]
CMP88  2AND  [2AND]
CMP92  2OR  [2OR]

### Nets
BRANCH_NOT_TAKEN: CMP88.OUT_P(P) ; also sheet 13
BRANCH_TAKEN: CMP86.OUT_P(P) ; also sheet 13
MATCH: CMP86.P$2 ; also sheet 1
MATCH_N: CMP88.P$2 ; also sheet 1
OPCODE_IS_ANDI_ORI_PS: CMP25.OUT_P(P) ; also sheet 13
OPCODE_IS_ANDI_PS: CMP25.P$2(A1) ; also sheet 2,9
OPCODE_IS_BRANCH_GROUP: CMP88.P$1 ; also sheet 2,6,12,13
OPCODE_IS_MOVE_R0_SP: CMP26.P$1(A2) ; also sheet 2
OPCODE_IS_MOVE_SP_R0: CMP26.P$2(A1) ; also sheet 2,12
OPCODE_IS_MOVER_SP: CMP26.OUT_P(P) ; also sheet 13
OPCODE_IS_ORI_PS: CMP25.P$1(A2) ; also sheet 2,9
OPCODE_IS_POP_PS: CMP92.P$1(A2) ; also sheet 3
OPCODE_IS_POP_RA: CMP92.P$2(A1) ; also sheet 3
OPCODE_IS_POP_RA_PS: CMP92.OUT_P(P) ; also sheet 12
OPCODE_IS_RET: CMP73.P$1(A2) ; also sheet 3,13
OPCODE_IS_RET_RETI: CMP73.OUT_P(P) ; also sheet 12
OPCODE_IS_RETI: CMP73.P$2(A1) ; also sheet 3,13
STATE_0: CMP86.P$1 ; also sheet 1,6,7
Unconnected: CMP25.OUT_M(N) CMP26.OUT_M(N) CMP73.OUT_M(N) CMP86.OUT_M(N) CMP88.OUT_M(N) CMP92.OUT_M(N)

### Notes on the sheet
- opcode_is_andi_ori_ps = Cpnt_2OR(opcode_is_andi_ps, opcode_is_ori_ps);
- opcode_is_mover_sp   = Cpnt_2OR(opcode_is_move_sp_r0, opcode_is_move_r0_sp);
- opcode_is_ret_reti = Cpnt_2OR(opcode_is_ret, opcode_is_reti);
- opcode_is_pop_ra_ps = Cpnt_2OR(opcode_is_pop_ra, opcode_is_pop_ps);
- branch_taken = Cpnt_2AND(bus_state[0], bus_match_cc.match);
- branch_not_taken = Cpnt_2AND(opcode_is_branch_group, bus_match_cc.match_n);

## Sheet 9 of 13
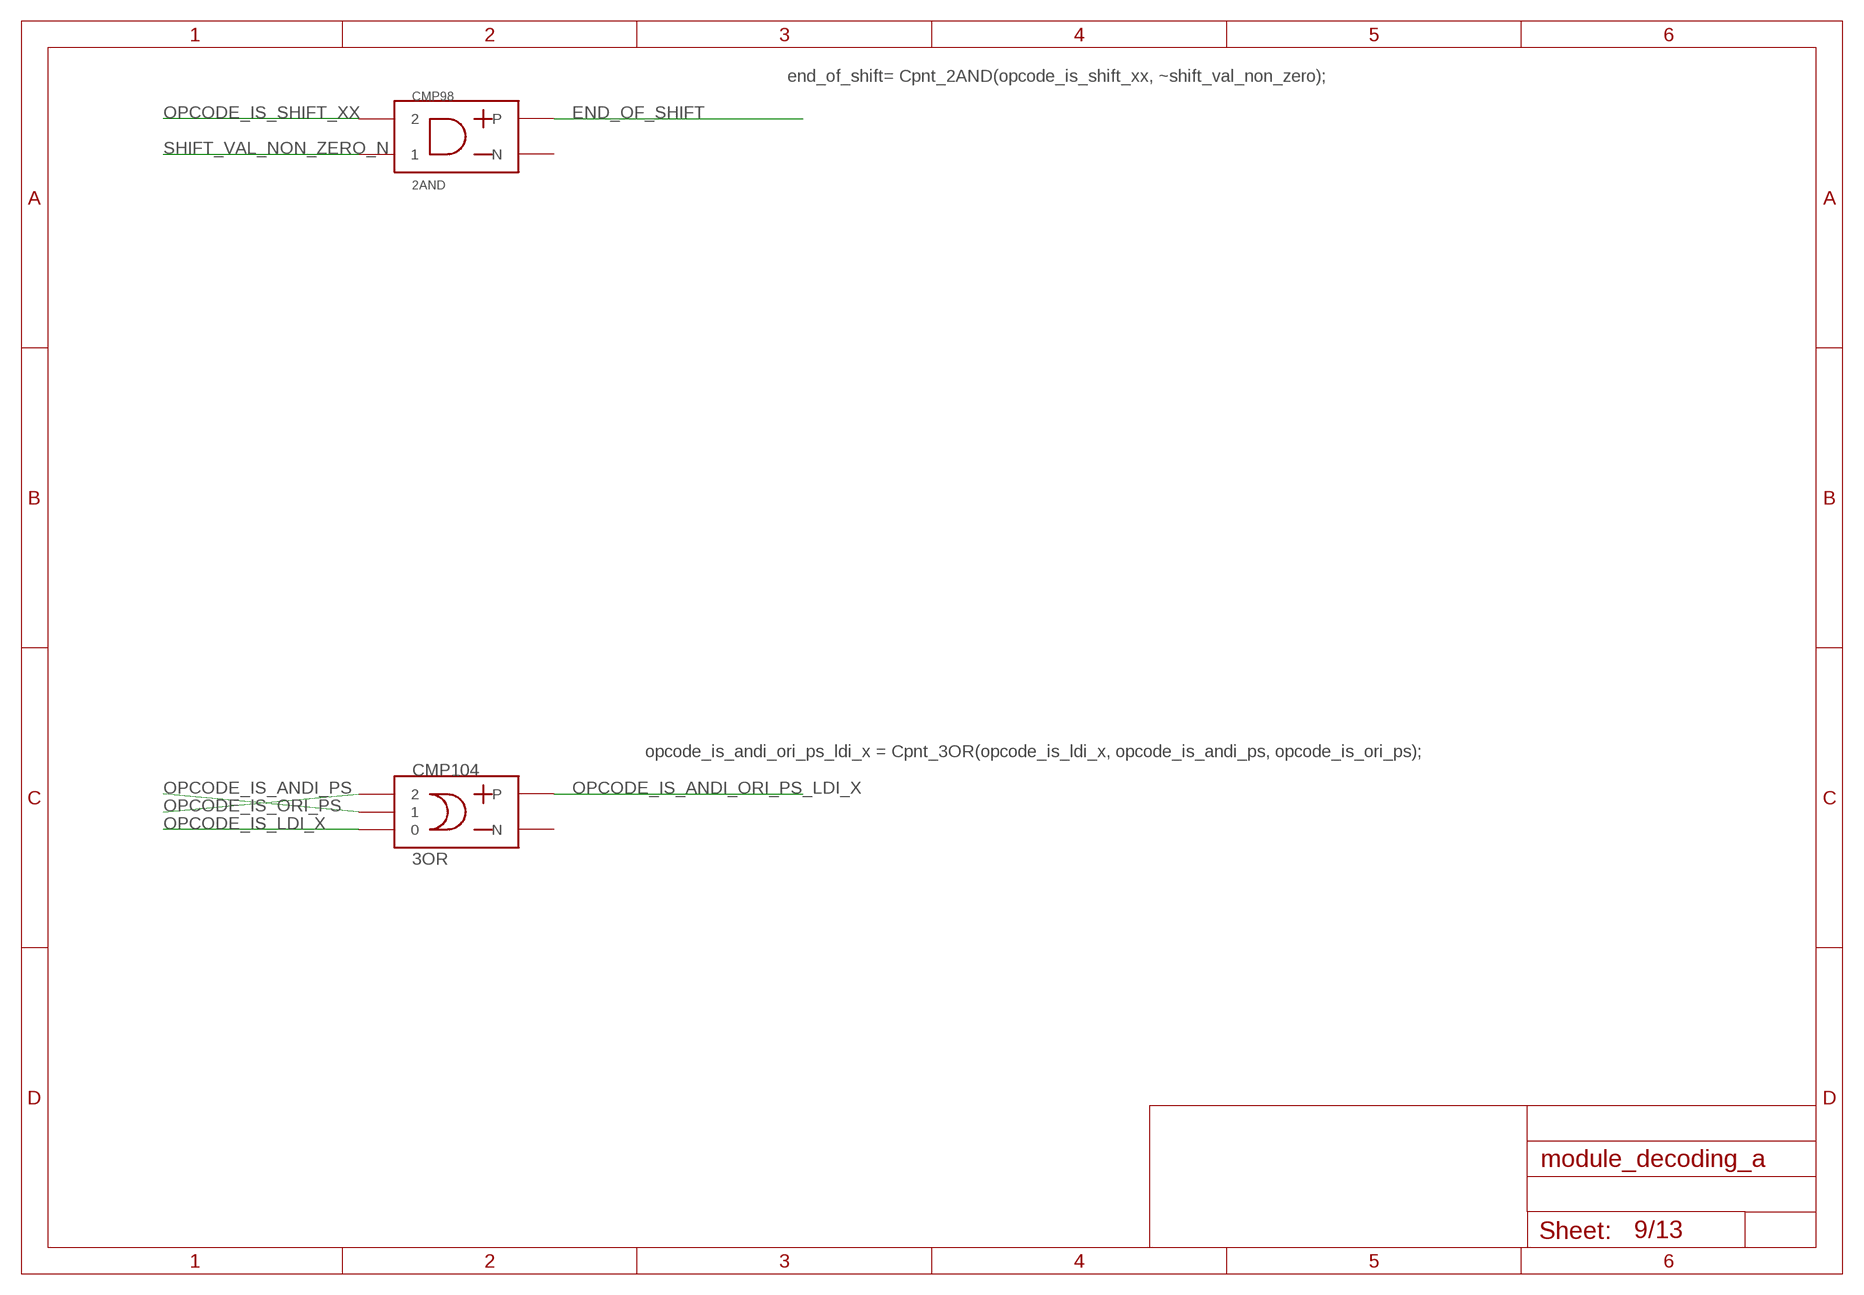
[diagram p8: schematic, sheet 9]

### Parts
CMP98  2AND  [2AND]
CMP104  3OR  [3OR]

### Nets
END_OF_SHIFT: CMP98.OUT_P(P) ; also sheet 13
OPCODE_IS_ANDI_ORI_PS_LDI_X: CMP104.OUT_P(P) ; also sheet 12
OPCODE_IS_ANDI_PS: CMP104.P$2 ; also sheet 2,8
OPCODE_IS_LDI_X: CMP104.P$1 ; also sheet 3,7
OPCODE_IS_ORI_PS: CMP104.P$3 ; also sheet 2,8
OPCODE_IS_SHIFT_XX: CMP98.P$2 ; also sheet 3,12,13
SHIFT_VAL_NON_ZERO_N: CMP98.P$1 ; also sheet 4
Unconnected: CMP98.OUT_M(N) CMP104.OUT_M(N)

### Notes on the sheet
- end_of_shift= Cpnt_2AND(opcode_is_shift_xx, ~shift_val_non_zero);
- opcode_is_andi_ori_ps_ldi_x = Cpnt_3OR(opcode_is_ldi_x, opcode_is_andi_ps, opcode_is_ori_ps);

## Sheet 10 of 13
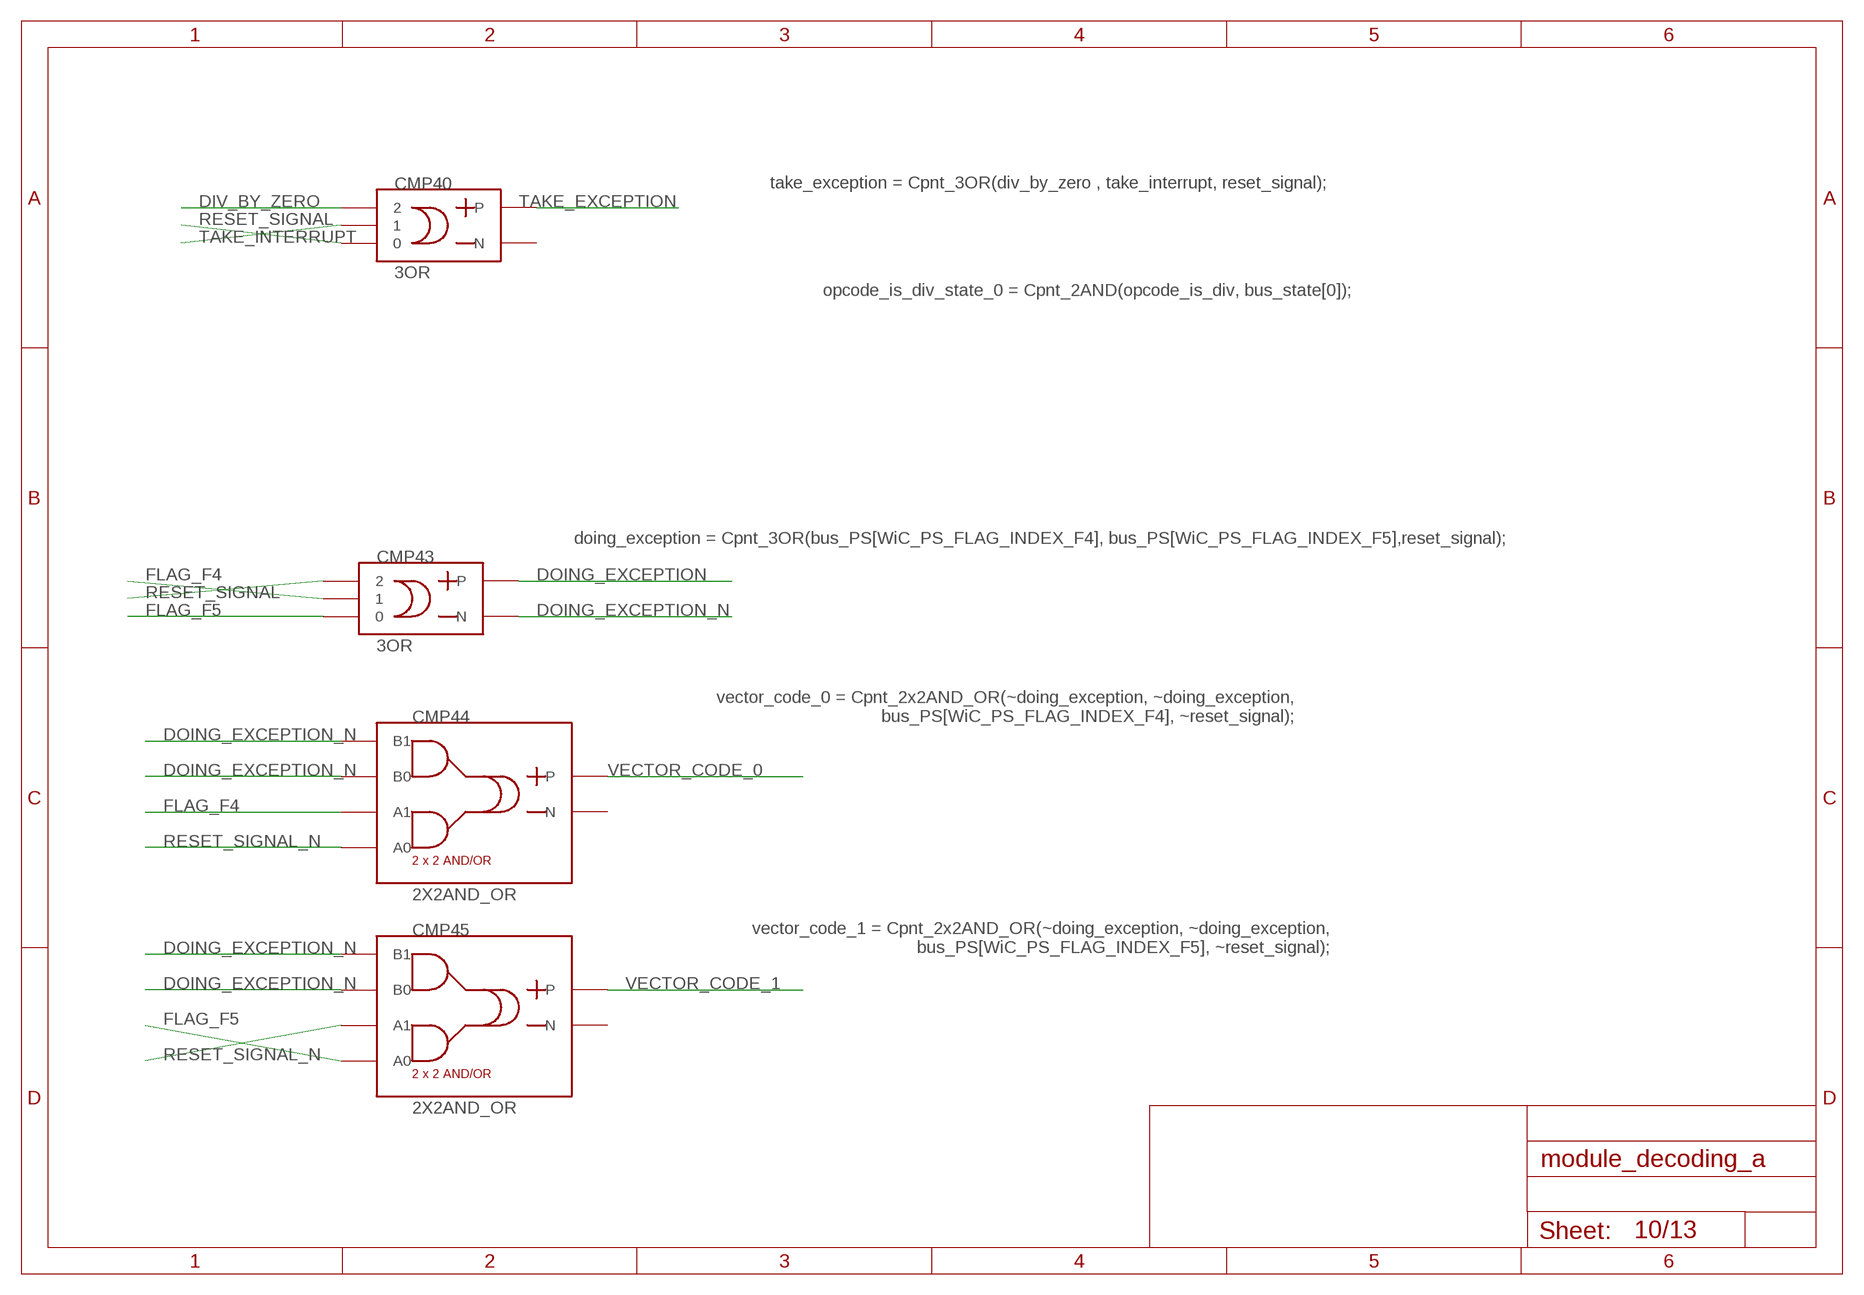
[diagram p9: schematic, sheet 10]

### Parts
CMP40  3OR  [3OR]
CMP43  3OR  [3OR]
CMP44  2X2AND_OR  [2X2AND_OR]
CMP45  2X2AND_OR  [2X2AND_OR]

### Nets
DIV_BY_ZERO: CMP40.P$3 ; also sheet 3,13
DOING_EXCEPTION: CMP43.OUT_P(P)
DOING_EXCEPTION_N: CMP43.OUT_M(N) CMP44.P$3(B0) CMP44.P$4(B1) CMP45.P$3(B0) CMP45.P$4(B1)
FLAG_F4: CMP43.P$2 CMP44.P$2(A1) ; also sheet 1
FLAG_F5: CMP43.P$1 CMP45.P$1(A0) ; also sheet 1
RESET_SIGNAL: CMP40.P$1 CMP43.P$3 ; also sheet 11
RESET_SIGNAL_N: CMP44.P$1(A0) CMP45.P$2(A1) ; also sheet 11
TAKE_EXCEPTION: CMP40.OUT_P(P) ; also sheet 12
TAKE_INTERRUPT: CMP40.P$2 ; also sheet 4
VECTOR_CODE_0: CMP44.OUT_P(P) ; also sheet 12
VECTOR_CODE_1: CMP45.OUT_P(P) ; also sheet 12
Unconnected: CMP40.OUT_M(N) CMP44.OUT_M(N) CMP45.OUT_M(N)

### Notes on the sheet
- take_exception = Cpnt_3OR(div_by_zero , take_interrupt, reset_signal);
- opcode_is_div_state_0 = Cpnt_2AND(opcode_is_div, bus_state[0]);
- doing_exception = Cpnt_3OR(bus_PS[WiC_PS_FLAG_INDEX_F4], bus_PS[WiC_PS_FLAG_INDEX_F5],reset_signal);
- vector_code_0 = Cpnt_2x2AND_OR(~doing_exception, ~doing_exception,
                                       bus_PS[WiC_PS_FLAG_INDEX_F4], ~reset_signal);
- vector_code_1 = Cpnt_2x2AND_OR(~doing_exception, ~doing_exception,
                                       bus_PS[WiC_PS_FLAG_INDEX_F5], ~reset_signal);

## Sheet 11 of 13
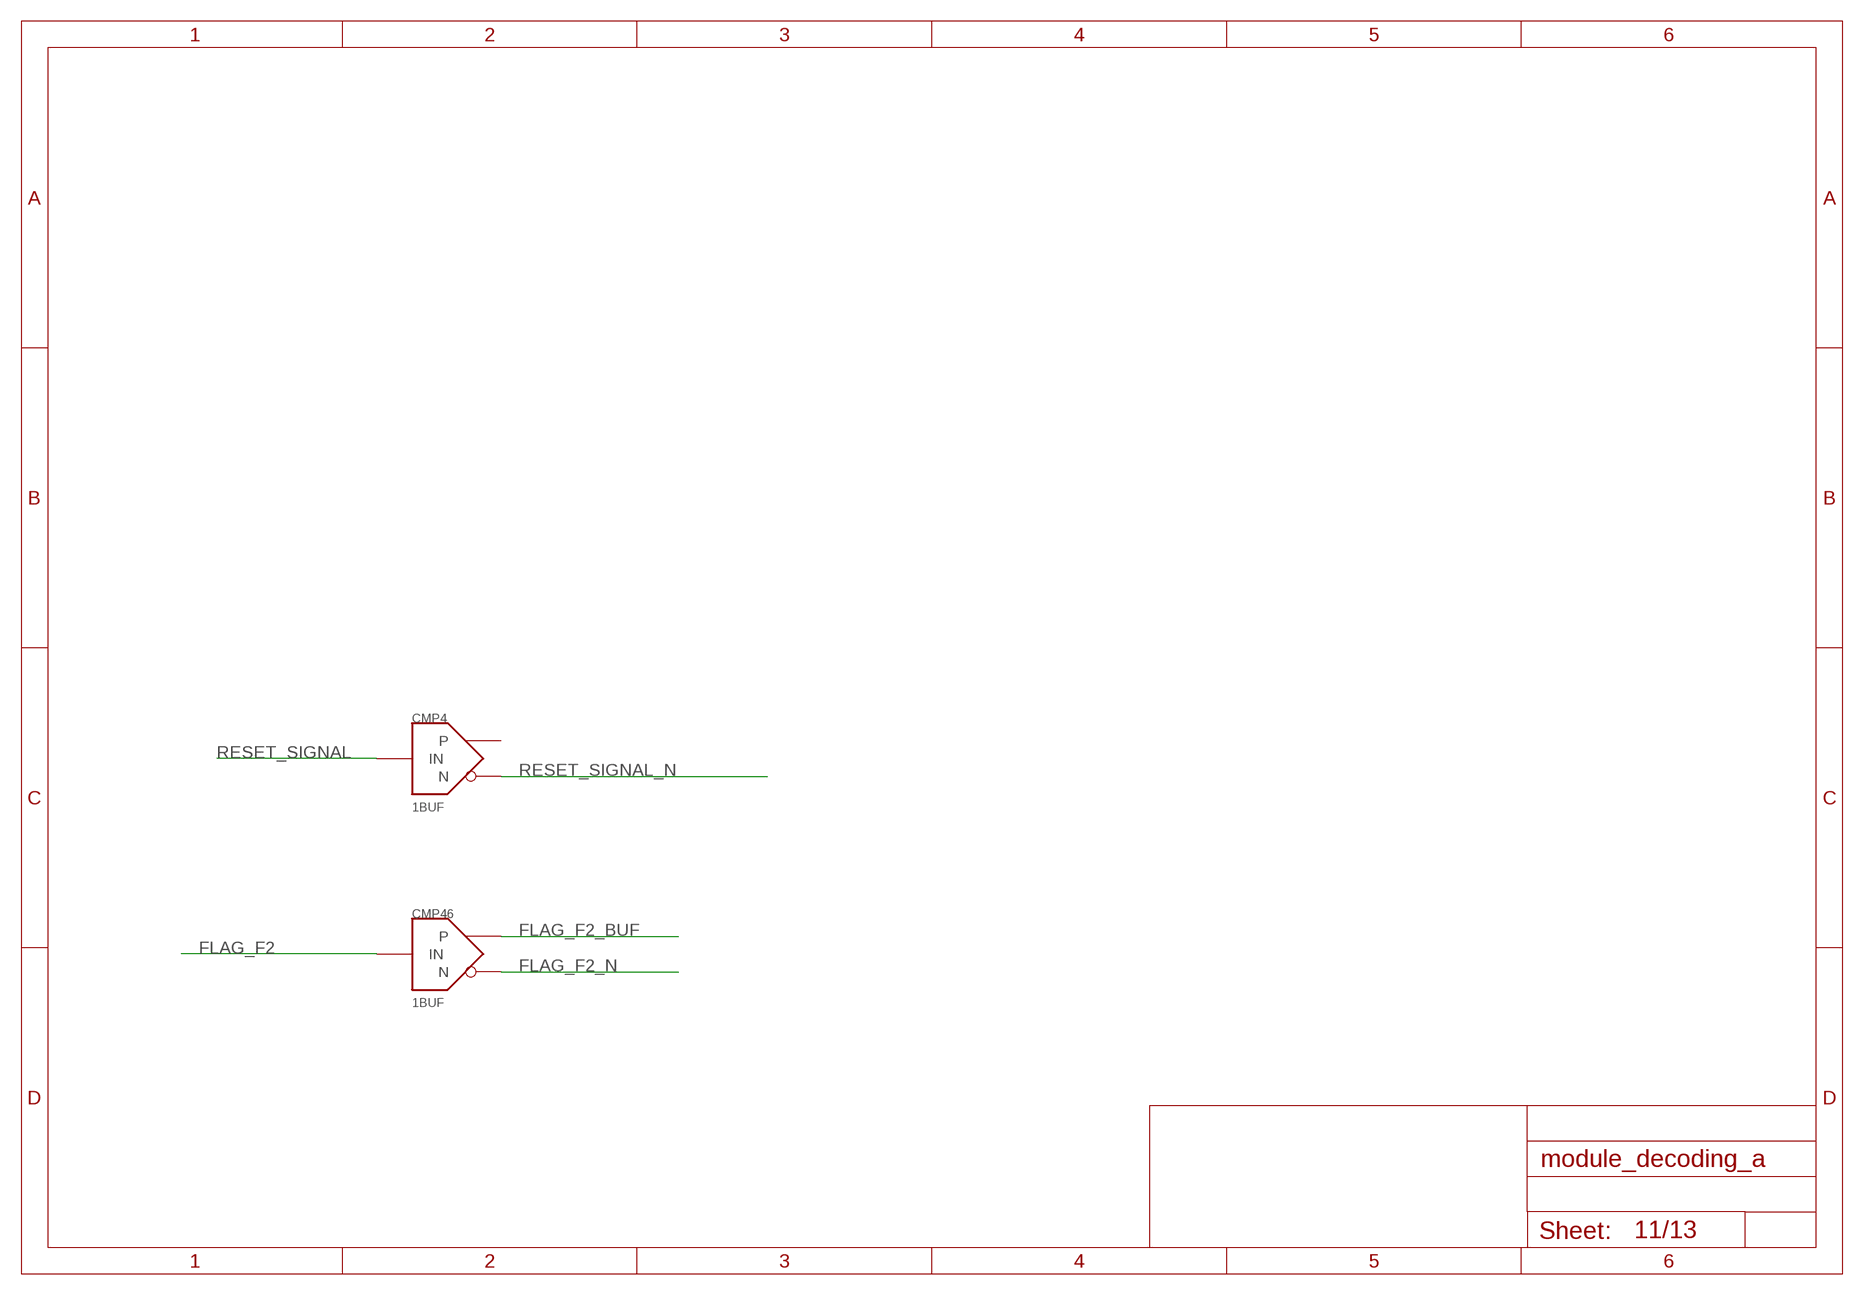
[diagram p10: schematic, sheet 11]

### Parts
CMP4  1BUF  [1BUF]
CMP46  1BUF  [1BUF]

### Nets
FLAG_F2: CMP46.IN ; also sheet 1
FLAG_F2_BUF: CMP46.P ; also sheet 13
FLAG_F2_N: CMP46.N ; also sheet 12
RESET_SIGNAL: CMP4.IN ; also sheet 10
RESET_SIGNAL_N: CMP4.N ; also sheet 10
Unconnected: CMP4.P

## Sheet 12 of 13
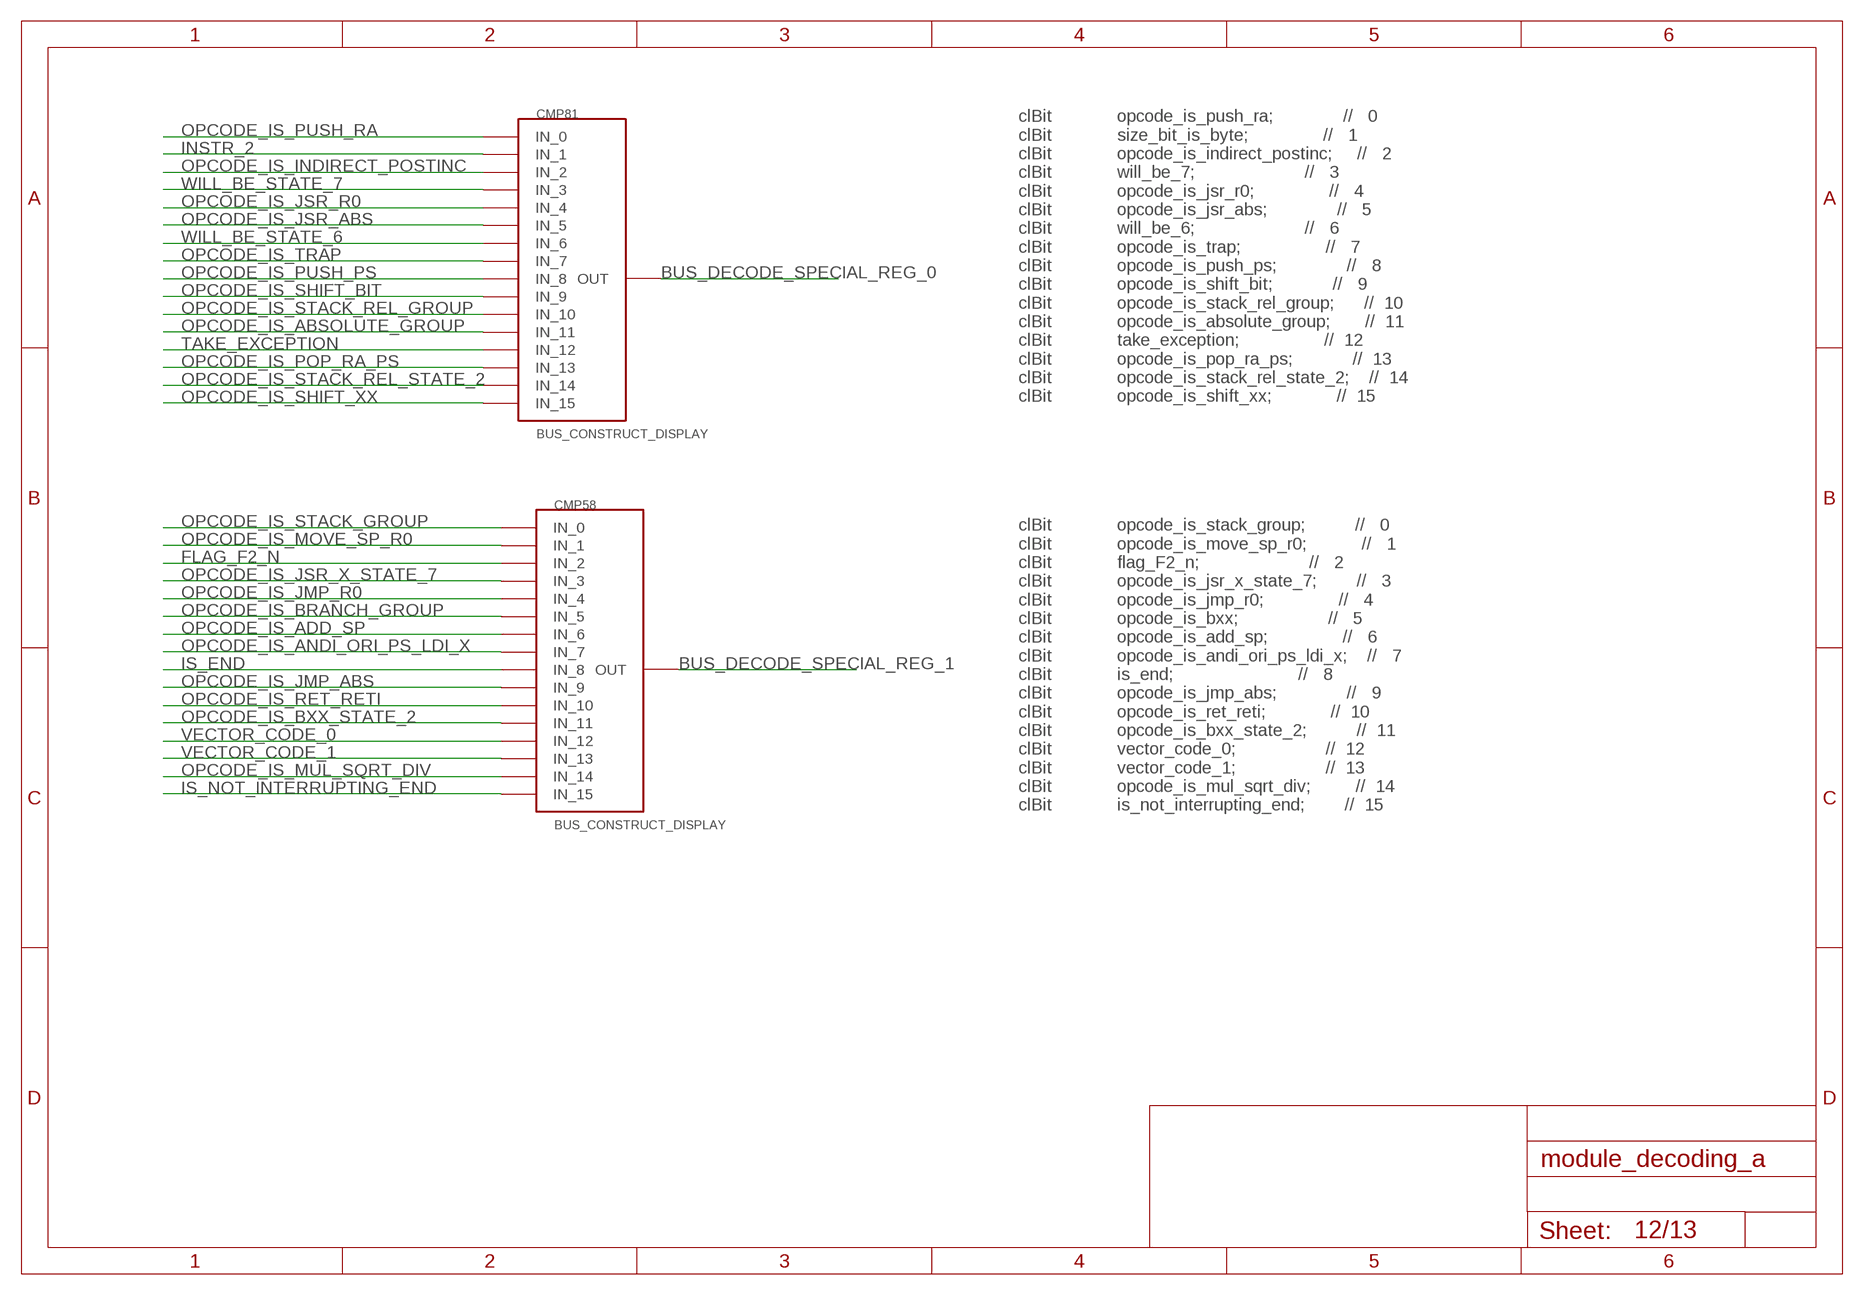
[diagram p11: schematic, sheet 12]

### Parts
CMP58  BUS_CONSTRUCT_DISPLAY  [BUS_SPLIT_DISPLAY]
CMP81  BUS_CONSTRUCT_DISPLAY  [BUS_SPLIT_DISPLAY]

### Nets
BUS_DECODE_SPECIAL_REG_0: CMP81.INPUT(OUT)
BUS_DECODE_SPECIAL_REG_1: CMP58.INPUT(OUT)
FLAG_F2_N: CMP58.P$3(IN_2) ; also sheet 11
INSTR_2: CMP81.P$2(IN_1) ; also sheet 1,5
IS_END: CMP58.P$9(IN_8) ; also sheet 4,13
IS_NOT_INTERRUPTING_END: CMP58.P$16(IN_15) ; also sheet 4
OPCODE_IS_ABSOLUTE_GROUP: CMP81.P$12(IN_11) ; also sheet 2,7,13
OPCODE_IS_ADD_SP: CMP58.P$7(IN_6) ; also sheet 2,6,13
OPCODE_IS_ANDI_ORI_PS_LDI_X: CMP58.P$8(IN_7) ; also sheet 9
OPCODE_IS_BRANCH_GROUP: CMP58.P$6(IN_5) ; also sheet 2,6,8,13
OPCODE_IS_BXX_STATE_2: CMP58.P$12(IN_11) ; also sheet 6
OPCODE_IS_INDIRECT_POSTINC: CMP81.P$3(IN_2) ; also sheet 2
OPCODE_IS_JMP_ABS: CMP58.P$10(IN_9) ; also sheet 2,13
OPCODE_IS_JMP_R0: CMP58.P$5(IN_4) ; also sheet 2,13
OPCODE_IS_JSR_ABS: CMP81.P$6(IN_5) ; also sheet 3,13
OPCODE_IS_JSR_R0: CMP81.P$5(IN_4) ; also sheet 3,7
OPCODE_IS_JSR_X_STATE_7: CMP58.P$4(IN_3) ; also sheet 6,13
OPCODE_IS_MOVE_SP_R0: CMP58.P$2(IN_1) ; also sheet 2,8
OPCODE_IS_MUL_SQRT_DIV: CMP58.P$15(IN_14) ; also sheet 3
OPCODE_IS_POP_RA_PS: CMP81.P$14(IN_13) ; also sheet 8
OPCODE_IS_PUSH_PS: CMP81.P$9(IN_8) ; also sheet 3
OPCODE_IS_PUSH_RA: CMP81.P$1(IN_0) ; also sheet 3
OPCODE_IS_RET_RETI: CMP58.P$11(IN_10) ; also sheet 8
OPCODE_IS_SHIFT_BIT: CMP81.P$10(IN_9) ; also sheet 3
OPCODE_IS_SHIFT_XX: CMP81.P$16(IN_15) ; also sheet 3,9,13
OPCODE_IS_STACK_GROUP: CMP58.P$1(IN_0) ; also sheet 2
OPCODE_IS_STACK_REL_GROUP: CMP81.P$11(IN_10) ; also sheet 2,6,13
OPCODE_IS_STACK_REL_STATE_2: CMP81.P$15(IN_14) ; also sheet 6,7
OPCODE_IS_TRAP: CMP81.P$8(IN_7) ; also sheet 3,13
TAKE_EXCEPTION: CMP81.P$13(IN_12) ; also sheet 10
VECTOR_CODE_0: CMP58.P$13(IN_12) ; also sheet 10
VECTOR_CODE_1: CMP58.P$14(IN_13) ; also sheet 10
WILL_BE_STATE_6: CMP81.P$7(IN_6) ; also sheet 7,13
WILL_BE_STATE_7: CMP81.P$4(IN_3) ; also sheet 7,13

### Notes on the sheet
- clBit             opcode_is_push_ra;              //   0
      clBit             size_bit_is_byte;               //   1
      clBit             opcode_is_indirect_postinc;     //   2
      clBit             will_be_7;                      //   3
      clBit             opcode_is_jsr_r0;               //   4
      clBit             opcode_is_jsr_abs;              //   5
      clBit             will_be_6;                      //   6
      clBit             opcode_is_trap;                 //   7
      clBit             opcode_is_push_ps;              //   8
      clBit             opcode_is_shift_bit;            //   9
      clBit             opcode_is_stack_rel_group;      //  10
      clBit             opcode_is_absolute_group;       //  11
      clBit             take_exception;                 //  12
      clBit             opcode_is_pop_ra_ps;            //  13
      clBit             opcode_is_stack_rel_state_2;    //  14
      clBit             opcode_is_shift_xx;             //  15
- clBit             opcode_is_stack_group;          //   0
      clBit             opcode_is_move_sp_r0;           //   1
      clBit             flag_F2_n;                      //   2
      clBit             opcode_is_jsr_x_state_7;        //   3
      clBit             opcode_is_jmp_r0;               //   4
      clBit             opcode_is_bxx;                  //   5
      clBit             opcode_is_add_sp;               //   6
      clBit             opcode_is_andi_ori_ps_ldi_x;    //   7
      clBit             is_end;                         //   8
      clBit             opcode_is_jmp_abs;              //   9
      clBit             opcode_is_ret_reti;             //  10
      clBit             opcode_is_bxx_state_2;          //  11
      clBit             vector_code_0;                  //  12
      clBit             vector_code_1;                  //  13
      clBit             opcode_is_mul_sqrt_div;         //  14
      clBit             is_not_interrupting_end;        //  15

## Sheet 13 of 13
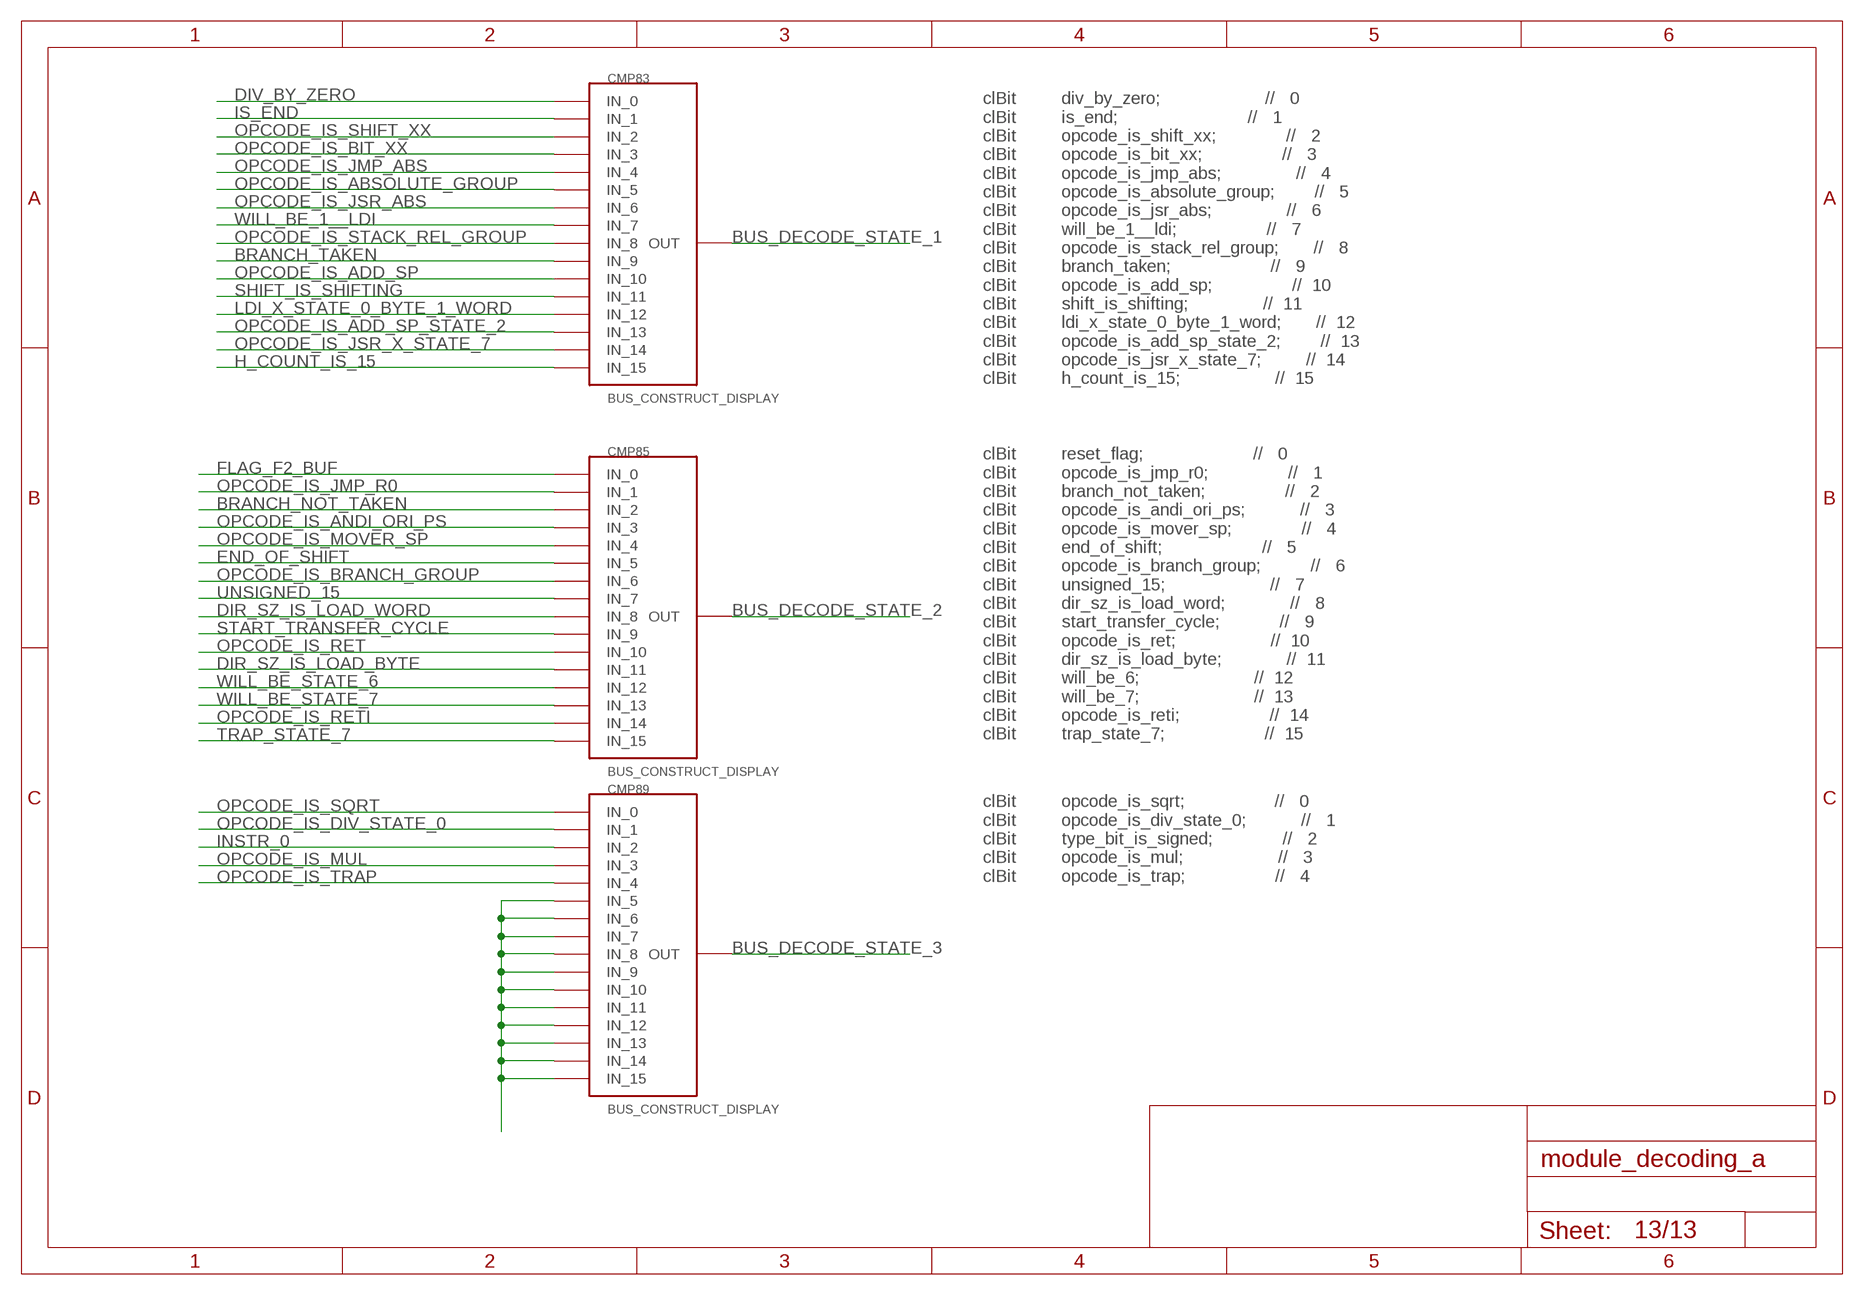
[diagram p12: schematic, sheet 13]

### Parts
CMP83  BUS_CONSTRUCT_DISPLAY  [BUS_SPLIT_DISPLAY]
CMP85  BUS_CONSTRUCT_DISPLAY  [BUS_SPLIT_DISPLAY]
CMP89  BUS_CONSTRUCT_DISPLAY  [BUS_SPLIT_DISPLAY]

### Nets
BRANCH_NOT_TAKEN: CMP85.P$3(IN_2) ; also sheet 8
BRANCH_TAKEN: CMP83.P$10(IN_9) ; also sheet 8
BUS_DECODE_STATE_1: CMP83.INPUT(OUT)
BUS_DECODE_STATE_2: CMP85.INPUT(OUT)
BUS_DECODE_STATE_3: CMP89.INPUT(OUT)
DIR_SZ_IS_LOAD_BYTE: CMP85.P$12(IN_11) ; also sheet 5
DIR_SZ_IS_LOAD_WORD: CMP85.P$9(IN_8) ; also sheet 5
DIV_BY_ZERO: CMP83.P$1(IN_0) ; also sheet 3,10
END_OF_SHIFT: CMP85.P$6(IN_5) ; also sheet 9
FLAG_F2_BUF: CMP85.P$1(IN_0) ; also sheet 11
H_COUNT_IS_15: CMP83.P$16(IN_15) ; also sheet 4,7
INSTR_0: CMP89.P$3(IN_2) ; also sheet 1
IS_END: CMP83.P$2(IN_1) ; also sheet 4,12
LDI_X_STATE_0_BYTE_1_WORD: CMP83.P$13(IN_12) ; also sheet 4
N$3: CMP89.P$6(IN_5) CMP89.P$7(IN_6) CMP89.P$8(IN_7) CMP89.P$9(IN_8) CMP89.P$10(IN_9) CMP89.P$11(IN_10) CMP89.P$12(IN_11) CMP89.P$13(IN_12) CMP89.P$14(IN_13) CMP89.P$15(IN_14) CMP89.P$16(IN_15)
OPCODE_IS_ABSOLUTE_GROUP: CMP83.P$6(IN_5) ; also sheet 2,7,12
OPCODE_IS_ADD_SP: CMP83.P$11(IN_10) ; also sheet 2,6,12
OPCODE_IS_ADD_SP_STATE_2: CMP83.P$14(IN_13) ; also sheet 6
OPCODE_IS_ANDI_ORI_PS: CMP85.P$4(IN_3) ; also sheet 8
OPCODE_IS_BIT_XX: CMP83.P$4(IN_3) ; also sheet 3
OPCODE_IS_BRANCH_GROUP: CMP85.P$7(IN_6) ; also sheet 2,6,8,12
OPCODE_IS_DIV_STATE_0: CMP89.P$2(IN_1) ; also sheet 6
OPCODE_IS_JMP_ABS: CMP83.P$5(IN_4) ; also sheet 2,12
OPCODE_IS_JMP_R0: CMP85.P$2(IN_1) ; also sheet 2,12
OPCODE_IS_JSR_ABS: CMP83.P$7(IN_6) ; also sheet 3,12
OPCODE_IS_JSR_X_STATE_7: CMP83.P$15(IN_14) ; also sheet 6,12
OPCODE_IS_MOVER_SP: CMP85.P$5(IN_4) ; also sheet 8
OPCODE_IS_MUL: CMP89.P$4(IN_3) ; also sheet 2
OPCODE_IS_RET: CMP85.P$11(IN_10) ; also sheet 3,8
OPCODE_IS_RETI: CMP85.P$15(IN_14) ; also sheet 3,8
OPCODE_IS_SHIFT_XX: CMP83.P$3(IN_2) ; also sheet 3,9,12
OPCODE_IS_SQRT: CMP89.P$1(IN_0) ; also sheet 2
OPCODE_IS_STACK_REL_GROUP: CMP83.P$9(IN_8) ; also sheet 2,6,12
OPCODE_IS_TRAP: CMP89.P$5(IN_4) ; also sheet 3,12
SHIFT_IS_SHIFTING: CMP83.P$12(IN_11) ; also sheet 4
START_TRANSFER_CYCLE: CMP85.P$10(IN_9) ; also sheet 7
TRAP_STATE_7: CMP85.P$16(IN_15) ; also sheet 4
UNSIGNED_15: CMP85.P$8(IN_7) ; also sheet 7
WILL_BE_1__LDI: CMP83.P$8(IN_7) ; also sheet 7
WILL_BE_STATE_6: CMP85.P$13(IN_12) ; also sheet 7,12
WILL_BE_STATE_7: CMP85.P$14(IN_13) ; also sheet 7,12

### Notes on the sheet
- clBit         div_by_zero;                     //   0
      clBit         is_end;                          //   1
      clBit         opcode_is_shift_xx;              //   2
      clBit         opcode_is_bit_xx;                //   3
      clBit         opcode_is_jmp_abs;               //   4
      clBit         opcode_is_absolute_group;        //   5
      clBit         opcode_is_jsr_abs;               //   6
      clBit         will_be_1__ldi;                  //   7
      clBit         opcode_is_stack_rel_group;       //   8
      clBit         branch_taken;                    //   9
      clBit         opcode_is_add_sp;                //  10
      clBit         shift_is_shifting;               //  11
      clBit         ldi_x_state_0_byte_1_word;       //  12
      clBit         opcode_is_add_sp_state_2;        //  13
      clBit         opcode_is_jsr_x_state_7;         //  14
      clBit         h_count_is_15;                   //  15
- clBit         reset_flag;                      //   0
      clBit         opcode_is_jmp_r0;                //   1
      clBit         branch_not_taken;                //   2
      clBit         opcode_is_andi_ori_ps;           //   3
      clBit         opcode_is_mover_sp;              //   4
      clBit         end_of_shift;                    //   5
      clBit         opcode_is_branch_group;          //   6
      clBit         unsigned_15;                     //   7
      clBit         dir_sz_is_load_word;             //   8
      clBit         start_transfer_cycle;            //   9
      clBit         opcode_is_ret;                   //  10
      clBit         dir_sz_is_load_byte;             //  11
      clBit         will_be_6;                       //  12
      clBit         will_be_7;                       //  13
      clBit         opcode_is_reti;                  //  14
      clBit         trap_state_7;                    //  15
- clBit         opcode_is_sqrt;                  //   0
      clBit         opcode_is_div_state_0;           //   1
      clBit         type_bit_is_signed;              //   2
      clBit         opcode_is_mul;                   //   3
      clBit         opcode_is_trap;                  //   4

## Library data of the parts
CMP1 = modules:DECODER4
CMP2 CMP3 CMP13 CMP15 CMP17 CMP35 CMP47 CMP57 CMP90 = modules:BUS_SPLIT_DISPLAY
CMP4 CMP46 = modules:1BUF
CMP18-CMP21 CMP41 CMP65 CMP66 CMP86 CMP88 CMP98 = modules:2AND
CMP25 CMP26 CMP33 CMP73 CMP92 = modules:2OR
CMP31 = modules:4X2AND_OR
CMP32 CMP34 CMP44 CMP45 = modules:2X2AND_OR
CMP40 CMP43 CMP104 = modules:3OR
CMP58 CMP81 CMP83 CMP85 CMP89 = modules:BUS_CONSTRUCT_DISPLAY

## Board
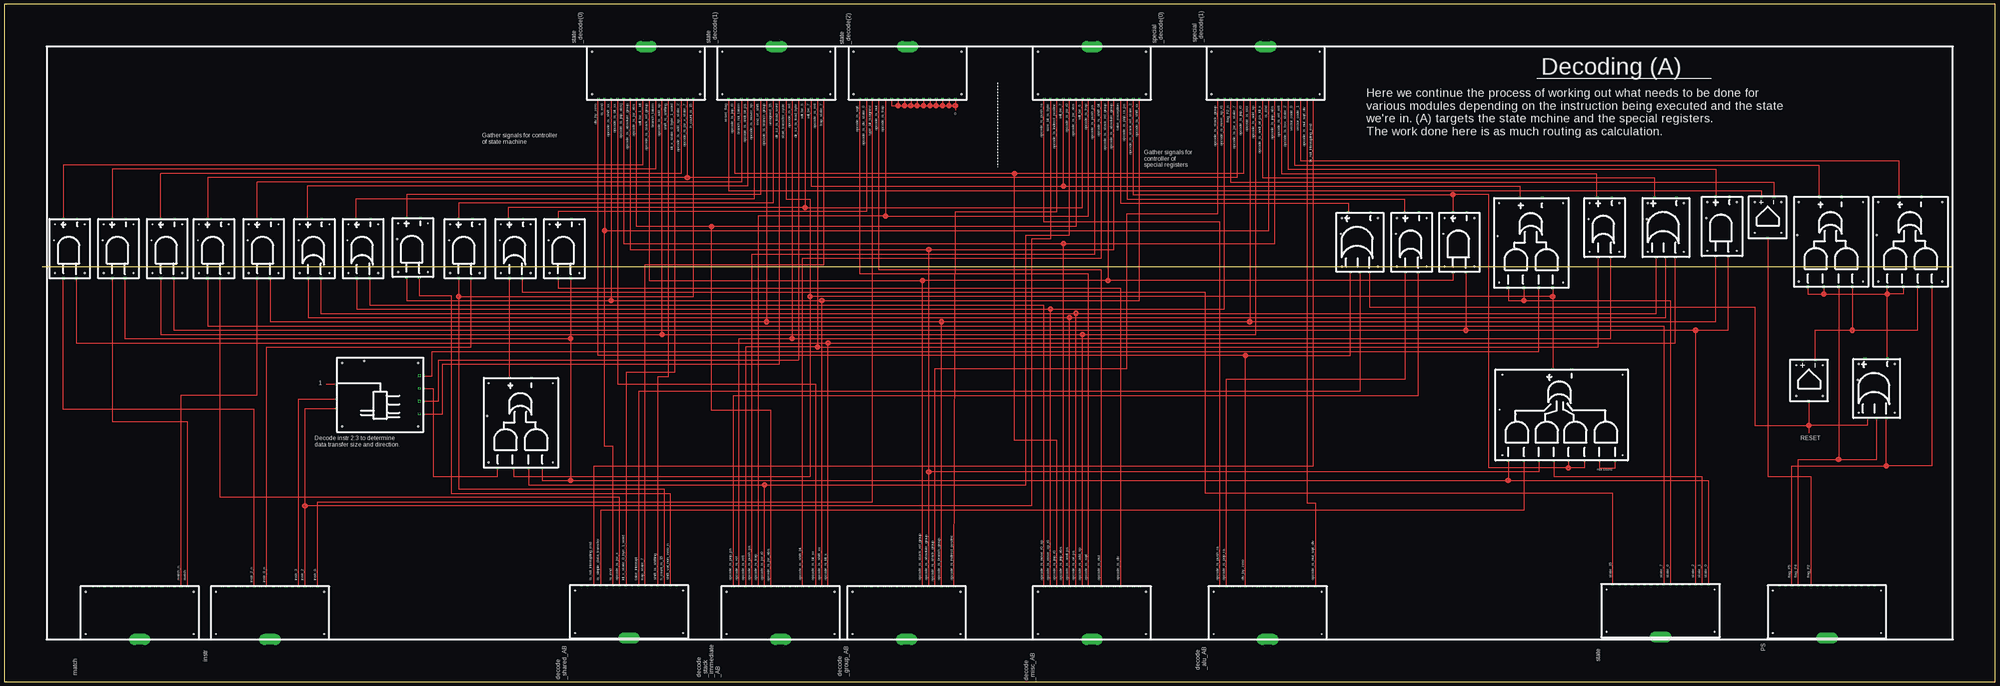
[diagram p13: board, top side]

Size 1193.8 x 406.4 mm. Coordinates in mm from the lower left corner, seen from the top.
Outline: 0,0 1193.8,0 1193.8,406.4 0,406.4 0,0
Copper layers (1*16): Top 0.035mm / dielectric 1.5mm / Bottom 0.035mm
Design rules "default": minimum track width 10mil, minimum drill 24mil, track to track 8mil, track to pad 8mil, pad to pad 8mil, via to via 8mil, smd to smd 8mil, copper to edge 40mil, drill to drill 8mil, minimum pad ring 10mil, minimum via ring 8mil, stop-mask expansion 4mil, vias tented up to drill 0mil, thermal gap 10mil
tKeepout: area 587.8,16.3 to 606,34.5; area 587.8,371.9 to 606,390.1; area 1159.3,371.9 to 1177.5,390.1; area 16.3,371.9 to 34.5,390.1; area 1159.3,16.3 to 1177.5,34.5; area 16.3,16.3 to 34.5,34.5
Milling: 1 lines

### Footprints (pad centres in the part's own frame; a part is rotated, then mirrored left to right if it is on the bottom)
DECODER4 = drill 0.8 square: A0 -24.765,-7.62; A1 -24.765,-1.905; E -24.765,6.985; N0 24.765,-10.795; N1 24.765,-3.175; N2 24.765,4.445; N3 24.765,12.065; P0 27.305,-10.795; P1 27.305,-3.175; P2 27.305,4.445; P3 27.305,12.065 | hole 0.6: 24.13,19.685; -21.59,19.685; -21.59,-18.415; 24.13,-18.415; -8.255,20.955
BUS_SPLIT_DISPLAY = drill 0.8 pad 6.452 long: INPUT 0,15.24 | drill 0.8 square: P$1 -28.575,-16.51; P$2 -24.765,-16.51; P$3 -20.955,-16.51; P$4 -17.145,-16.51; P$5 -13.335,-16.51; P$6 -9.525,-16.51; P$7 -5.715,-16.51; P$8 -1.905,-16.51; P$9 1.905,-16.51; P$10 5.715,-16.51; P$11 9.525,-16.51; P$12 13.335,-16.51; P$13 17.145,-16.51; P$14 20.955,-16.51; P$15 24.765,-16.51; P$16 28.575,-16.51 | hole 0.6: -32.385,-13.335; -32.385,12.065; 32.385,12.065; 32.385,-13.335
1BUF = drill 0.8 square: IN -12.7,0; N 12.065,-3.81; P 12.065,3.81 | hole 0.6: -9.525,7.62; -9.525,-8.255; 8.89,-8.255; 8.89,7.62
2AND = drill 0.8 square: OUT_M 19.05,-4.445; OUT_P 19.05,3.81; P$1 -16.51,-3.81; P$2 -16.51,3.81 | hole 0.6: -13.335,8.89; 15.875,-8.89; -13.335,-8.89; 15.875,8.89; 6.35,9.525
2OR = drill 0.8 square: OUT_M 17.78,-4.445; OUT_P 17.78,4.445; P$1 -17.78,-3.81; P$2 -17.78,3.81 | hole 0.6: -14.605,8.89; 14.605,-8.89; 14.605,8.89; -14.605,-8.89; 5.08,9.525
4X2AND_OR = drill 0.8 square: OUT_M 26.67,-6.985; OUT_P 26.67,4.445; P$1 -27.94,-33.02; P$2 -27.94,-23.495; P$3 -27.94,-14.605; P$4 -27.94,-5.08; P$5 -27.94,3.81; P$6 -27.94,12.7; P$7 -27.94,21.59; P$8 -27.94,31.115 | hole 0.6: -24.765,-37.465; 23.495,-37.465; 23.495,34.608; -24.765,34.608; 2.54,36.195
2X2AND_OR = drill 0.8 square: OUT_M 27.94,-6.985; OUT_P 27.94,6.35; P$1 -26.035,-13.335; P$2 -26.035,-5.08; P$3 -26.035,3.81; P$4 -26.035,13.335 | hole 0.6: -22.86,18.733; 24.765,18.733; -22.86,-19.685; 24.765,-19.685; 5.08,19.685
3OR = drill 0.8 square: OUT_M 16.51,-6.985; OUT_P 16.51,6.35; P$1 -19.05,-6.35; P$2 -19.05,-0.635; P$3 -19.05,5.08 | hole 0.6: -15.875,-11.43; 13.335,-11.43; 13.335,10.16; -15.875,10.16; 3.81,10.795

### Placement (x,y rotation side)
CMP1  224.16,171.45 0 top
CMP2  541.02,40.64 180 top
CMP3  465.45,40.64 180 top
CMP4  1082.04,180.97 90 top
CMP13  993.14,41.91 180 top
CMP15  159.38,40.64 180 top
CMP17  1092.84,41.27 180 top
CMP18  97.79,258.44 90 top
CMP19  1029.97,271.78 90 top
CMP20  872.49,262.25 90 top
CMP21  125.73,258.44 90 top
CMP25  186.06,259.71 90 top
CMP26  215.26,259.71 90 top
CMP31  932.82,160.66 90 top
CMP32  309.25,154.31 90 top
CMP33  306.7,259.71 90 top
CMP34  915.03,262.25 90 top
CMP35  652.14,40.64 180 top
CMP40  812.16,264.8 90 top
CMP41  335.92,258.44 90 top
CMP43  1122.05,177.16 90 top
CMP44  1094.74,262.89 90 top
CMP45  1142.37,262.89 90 top
CMP46  1057.28,278.76 90 top
CMP47  757.55,40.64 180 top
CMP57  374.65,41.27 180 top
CMP58  756.28,365.76 0 top
CMP65  276.23,258.44 90 top
CMP66  39.37,258.44 90 top
CMP73  959.49,272.42 90 top
CMP81  652.14,365.76 0 top
CMP83  384.81,365.76 0 top
CMP85  462.92,365.76 0 top
CMP86  68.58,258.44 90 top
CMP88  155.57,258.44 90 top
CMP89  541.65,365.76 0 top
CMP90  81.28,40.64 180 top
CMP92  843.91,263.52 90 top
CMP98  245.11,259.08 90 top
CMP104  995.68,273.69 90 top

### Tracks (layer width: path | path; a pad name or v marks a point on that pad's centre or on a via)
BRANCH_NOT_TAKEN
  Top 0.61: CMP85.P$3 441.96,299.72 151.76,299.72 CMP88.OUT_P
BRANCH_TAKEN
  Top 0.61: CMP83.P$10 390.52,307.34 64.77,307.34 CMP86.OUT_P
DIR_SZ_IS_LOAD_BYTE
  Top 0.61: CMP1.P1 260.35,168.28 260.35,193.04 476.25,193.04 CMP85.P$12
DIR_SZ_IS_LOAD_WORD
  Top 0.61: CMP1.P0 262.89,160.66 262.89,190.5 464.82,190.5 CMP85.P$9
DIR_SZ_IS_STORE_BYTE
  Top 0.61: CMP1.P3 256.54,183.51 256.54,198.12 920.12,198.12 CMP34.P$2
DIR_SZ_IS_STORE_WORD
  Top 0.61: CMP1.P2 257.18,175.9 257.18,123.19 295.91,123.19 CMP32.P$4
DIV_BY_ZERO
  Top 0.61: CMP47.P$12 744.22,195.58 | 744.22,195.58 356.24,195.58 CMP83.P$1 | 744.22,195.58 807.09,195.58 CMP40.P$3
DOING_EXCEPTION_N
  Top 0.61: CMP43.OUT_M 1129.03,232.41 | 1129.03,232.41 CMP45.P$4 | CMP45.P$3 1138.56,232.41 1129.03,232.41 | CMP44.P$3 1090.93,232.41 | 1090.93,232.41 1129.03,232.41 | CMP44.P$4 1081.4,232.41 1090.93,232.41
END_OF_SHIFT
  Top 0.61: CMP85.P$6 453.39,292.1 241.3,292.1 CMP98.OUT_P
FLAG_F2
  Top 0.61: CMP46.IN 1057.28,123.19 1083.31,123.19 CMP17.P$11
FLAG_F2_BUF
  Top 0.61: CMP85.P$1 434.34,294.64 1053.46,294.64 CMP46.P
FLAG_F2_N
  Top 0.61: CMP58.P$3 735.33,299.72 1061.09,299.72 CMP46.N
FLAG_F4
  Top 0.61: CMP44.P$2 1099.82,133.35 | 1099.82,133.35 1122.68,133.35 CMP43.P$2 | CMP17.P$13 1075.69,133.35 1099.82,133.35
FLAG_F5
  Top 0.61: CMP17.P$14 1071.88,129.54 1128.39,129.54 | 1128.39,129.54 CMP43.P$1 | CMP45.P$1 1155.7,129.54 1128.39,129.54
H_COUNT_IS_15
  Top 0.61: CMP65.P$2 272.42,231.14 | 272.42,231.14 413.38,231.14 CMP83.P$16 | 272.42,231.14 272.42,115.57 395.61,115.57 CMP57.P$3
INSTR_0
  Top 0.61: CMP15.P$1 187.96,107.95 520.7,107.95 CMP89.P$3
INSTR_0_N
  Top 0.61: CMP15.P$9 157.48,200.66 280.04,200.66 CMP65.P$1
INSTR_2
  Top 0.61: CMP15.P$3 180.34,105.41 | 180.34,105.41 180.34,163.83 CMP1.A0 | CMP81.P$2 627.38,265.43 615.95,265.43 615.95,105.41 180.34,105.41
INSTR_2_N
  Top 0.61: CMP15.P$11 149.86,163.19 35.56,163.19 CMP66.P$2
INSTR_3
  Top 0.61: CMP15.P$4 176.53,169.54 CMP1.A1
IS_END
  Top 0.61: CMP83.P$2 360.05,270.51 | 360.05,270.51 758.19,270.51 CMP58.P$9 | CMP57.P$11 365.12,140.97 360.05,140.97 360.05,270.51
IS_NOT_INTERRUPTING_END
  Top 0.61: CMP57.P$14 353.69,129.54 784.86,129.54 CMP58.P$16
IS_SIMPLE_DATA_TRANSFER
  Top 0.61: CMP31.P$7 911.23,102.87 357.5,102.87 CMP57.P$13
LDI_X_STATE_0_BYTE_1_WORD
  Top 0.61: CMP83.P$13 401.95,185.42 372.75,185.42 CMP57.P$9
MATCH
  Top 0.61: CMP86.P$2 64.77,156.21 109.86,156.21 CMP90.P$1
MATCH_N
  Top 0.61: CMP90.P$2 106.05,172.09 151.76,172.09 CMP88.P$2
N$3
  Top 0.61: CMP89.P$16 570.23,345.44 | 570.23,345.44 570.23,342.9 | CMP89.P$6 532.13,345.44 535.94,345.44 | 535.94,345.44 539.75,345.44 | 539.75,345.44 543.56,345.44 | 543.56,345.44 547.37,345.44 | 547.37,345.44 551.18,345.44 | 551.18,345.44 554.99,345.44 | 554.99,345.44 558.8,345.44 | 558.8,345.44 562.61,345.44 | 562.61,345.44 566.42,345.44 | 566.42,345.44 570.23,345.44 | CMP89.P$15 566.42,345.44 | CMP89.P$13 558.8,345.44 | CMP89.P$14 562.61,345.44 | CMP89.P$12 554.99,345.44 | CMP89.P$11 551.18,345.44 | CMP89.P$10 547.37,345.44 | CMP89.P$9 543.56,345.44 | CMP89.P$8 539.75,345.44 | CMP89.P$7 535.94,345.44
N$4
  Top 0.61: CMP31.P$2 956.31,128.27 965.84,128.27 CMP31.P$1
N$6
  Top 0.61: 193.04,178.44 198.12,178.44
OPCODE_IS_ABSOLUTE_GROUP
  Top 0.61: CMP83.P$6 375.29,259.08 554.36,259.08 | 554.36,259.08 665.48,259.08 CMP81.P$12 | CMP2.P$5 554.36,125.73 | 554.36,125.73 554.36,259.08 | CMP31.P$6 920.12,125.73 554.36,125.73
OPCODE_IS_ADD_SP
  Top 0.61: CMP18.P$2 93.98,208.28 394.33,208.28 | 394.33,208.28 CMP83.P$11 | 394.33,208.28 646.43,208.28 | 646.43,208.28 750.57,208.28 CMP58.P$7 | CMP35.P$10 646.43,208.28
OPCODE_IS_ADD_SP_STATE_2
  Top 0.61: CMP83.P$14 405.76,304.8 93.98,304.8 CMP18.OUT_P
OPCODE_IS_ANDI_ORI_PS
  Top 0.61: CMP85.P$4 445.77,297.18 181.61,297.18 CMP25.OUT_P
OPCODE_IS_ANDI_ORI_PS_LDI_X
  Top 0.61: CMP58.P$8 754.38,302.26 989.33,302.26 CMP104.OUT_P
OPCODE_IS_ANDI_PS
  Top 0.61: CMP25.P$2 182.25,218.44 638.81,218.44 | 638.81,218.44 996.32,218.44 CMP104.P$2 | CMP35.P$12 638.81,218.44
OPCODE_IS_BIT_XX
  Top 0.61: CMP83.P$4 367.67,178.44 486.41,178.44 CMP3.P$3
OPCODE_IS_BRANCH_GROUP
  Top 0.61: CMP88.P$1 159.38,215.9 457.2,215.9 | CMP58.P$6 746.76,215.9 | CMP85.P$7 457.2,215.9 | 457.2,215.9 561.98,215.9 | 561.98,215.9 746.76,215.9 | CMP2.P$3 561.98,215.9 | 746.76,215.9 1026.16,215.9 CMP19.P$2
OPCODE_IS_BXX_STATE_2
  Top 0.61: CMP58.P$12 769.62,307.34 1026.16,307.34 CMP19.OUT_P
OPCODE_IS_DIV
  Top 0.61: CMP41.P$2 332.11,236.22 669.29,236.22 CMP35.P$4
OPCODE_IS_DIV_STATE_0
  Top 0.61: CMP89.P$2 516.89,281.94 332.11,281.94 CMP41.OUT_P
OPCODE_IS_INDIRECT_POSTINC
  Top 0.61: CMP2.P$1 570.23,281.94 631.19,281.94 CMP81.P$3
OPCODE_IS_JMP_ABS
  Top 0.61: CMP83.P$5 371.48,262.89 635,262.89 | 635,262.89 762,262.89 CMP58.P$10 | CMP35.P$13 635,262.89
OPCODE_IS_JMP_R0
  Top 0.61: CMP58.P$5 742.95,304.8 605.79,304.8 | 605.79,304.8 438.15,304.8 CMP85.P$2 | CMP35.P$14 631.19,144.78 605.79,144.78 605.79,304.8
OPCODE_IS_JSR_ABS
  Top 0.61: CMP81.P$6 642.62,273.05 424.18,273.05 | 424.18,273.05 379.1,273.05 CMP83.P$7 | CMP3.P$10 459.74,162.56 424.18,162.56 424.18,273.05
OPCODE_IS_JSR_R0
  Top 0.61: CMP32.P$2 314.32,118.11 455.93,118.11 | 455.93,118.11 612.77,118.11 612.77,267.97 638.81,267.97 CMP81.P$5 | CMP3.P$11 455.93,118.11
OPCODE_IS_JSR_X
  Top 0.61: CMP21.P$1 129.54,110.49 368.94,110.49 CMP57.P$10
OPCODE_IS_JSR_X_STATE_7
  Top 0.61: CMP83.P$15 409.57,302.26 | 409.57,302.26 121.92,302.26 CMP21.OUT_P | CMP58.P$4 739.14,302.26 409.57,302.26
OPCODE_IS_LDI_X
  Top 0.61: CMP66.P$1 43.18,203.2 494.03,203.2 | 494.03,203.2 1002.03,203.2 CMP104.P$1 | CMP3.P$1 494.03,203.2
OPCODE_IS_MOVE_R0_SP
  Top 0.61: CMP26.P$1 219.07,226.06 623.57,226.06 CMP35.P$16
OPCODE_IS_MOVE_SP_R0
  Top 0.61: CMP26.P$2 211.46,223.52 627.38,223.52 | 627.38,223.52 731.52,223.52 CMP58.P$2 | CMP35.P$15 627.38,223.52
OPCODE_IS_MOVER_SP
  Top 0.61: CMP85.P$5 449.58,289.56 210.82,289.56 CMP26.OUT_P
OPCODE_IS_MUL
  Top 0.61: CMP35.P$7 657.86,247.01 524.51,247.01 CMP89.P$4
OPCODE_IS_MUL_SQRT_DIV
  Top 0.61: CMP58.P$15 781.05,107.31 786.13,107.31 CMP47.P$1
OPCODE_IS_ORI_PS
  Top 0.61: CMP25.P$1 189.87,220.98 642.62,220.98 | 642.62,220.98 990.6,220.98 CMP104.P$3 | CMP35.P$11 642.62,220.98
OPCODE_IS_POP_PS
  Top 0.61: CMP92.P$1 847.73,171.45 436.88,171.45 CMP3.P$16
OPCODE_IS_POP_RA
  Top 0.61: CMP47.P$15 732.79,181.61 840.11,181.61 CMP92.P$2
OPCODE_IS_POP_RA_PS
  Top 0.61: CMP81.P$14 673.1,289.56 839.47,289.56 CMP92.OUT_P
OPCODE_IS_PUSH_PS
  Top 0.61: CMP3.P$13 448.31,256.54 654.05,256.54 CMP81.P$9
OPCODE_IS_PUSH_RA
  Top 0.61: CMP47.P$16 728.98,275.59 623.57,275.59 CMP81.P$1
OPCODE_IS_RET
  Top 0.61: CMP85.P$11 472.44,205.74 | 472.44,205.74 963.29,205.74 CMP73.P$1 | CMP3.P$15 440.69,205.74 472.44,205.74
OPCODE_IS_RET_RETI
  Top 0.61: CMP58.P$11 765.81,304.8 955.04,304.8 CMP73.OUT_P
OPCODE_IS_RETI
  Top 0.61: CMP85.P$15 487.68,200.66 | 487.68,200.66 444.5,200.66 CMP3.P$14 | 487.68,200.66 955.67,200.66 CMP73.P$2
OPCODE_IS_SHIFT_BIT
  Top 0.61: CMP3.P$5 478.79,254 657.86,254 CMP81.P$10
OPCODE_IS_SHIFT_XX
  Top 0.61: CMP98.P$2 241.3,228.6 363.86,228.6 | CMP83.P$3 363.86,228.6 | 363.86,228.6 490.22,228.6 | 490.22,228.6 680.72,228.6 CMP81.P$16 | CMP3.P$2 490.22,228.6
OPCODE_IS_SQRT
  Top 0.61: CMP35.P$9 650.24,244.47 513.08,244.47 CMP89.P$1
OPCODE_IS_STACK_GROUP
  Top 0.61: CMP2.P$4 558.16,187.96 673.1,187.96 673.1,280.67 727.71,280.67 CMP58.P$1
OPCODE_IS_STACK_REL_GROUP
  Top 0.61: CMP83.P$9 386.71,240.66 550.54,240.66 | CMP2.P$6 550.54,240.66 | CMP20.P$2 868.68,240.66 661.67,240.66 | 661.67,240.66 550.54,240.66 | CMP81.P$11 661.67,240.66
OPCODE_IS_STACK_REL_STATE_2
  Top 0.61: CMP31.P$3 947.42,128.27 937.89,128.27 | 868.68,292.1 CMP20.OUT_P | CMP81.P$15 676.91,292.1 868.68,292.1 | 937.89,128.27 890.27,128.27 890.27,292.1 868.68,292.1 | CMP31.P$4 937.89,128.27
OPCODE_IS_TRAP
  Top 0.61: CMP89.P$5 528.32,279.4 | 528.32,279.4 650.24,279.4 CMP81.P$8 | 528.32,279.4 452.12,279.4 CMP3.P$12
RESET_SIGNAL
  Top 0.61: CMP4.IN 1082.04,153.67 | 1082.04,153.67 1082.04,149.22 | CMP43.P$3 1116.96,153.67 1082.04,153.67 | CMP40.P$1 818.51,224.79 1049.65,224.79 1049.65,153.67 1082.04,153.67
RESET_SIGNAL_N
  Top 0.61: CMP4.N 1085.85,210.82 1108.08,210.82 | 1108.08,210.82 1147.44,210.82 CMP45.P$2 | CMP44.P$1 1108.08,210.82
SHIFT_IS_SHIFTING
  Top 0.61: CMP83.P$12 398.14,182.88 391.8,182.88 CMP57.P$4
SHIFT_VAL_NON_ZERO_N
  Top 0.61: CMP98.P$1 248.92,231.78 267.97,231.78 267.97,113.03 399.42,113.03 CMP57.P$2
START_TRANSFER_CYCLE
  Top 0.61: CMP32.P$3 305.44,123.19 483.24,123.19 483.24,231.14 | CMP85.P$10 468.63,289.56 483.24,289.56 483.24,231.14 | CMP34.P$1 928.37,231.14 | 928.37,231.14 483.24,231.14 | 928.37,231.14 CMP31.OUT_P
STATE_0
  Top 0.61: CMP41.P$1 339.73,205.74 | 339.73,205.74 339.73,120.65 | CMP86.P$1 72.39,205.74 339.73,205.74 | CMP32.P$1 322.58,120.65 339.73,120.65 | 339.73,120.65 901.7,120.65 | 901.7,120.65 1021.72,120.65 CMP13.P$1 | CMP31.P$8 901.7,120.65
STATE_1
  Top 0.61: CMP31.P$5 929,123.19 1017.9,123.19 CMP13.P$2
STATE_2
  Top 0.61: CMP18.P$1 101.6,210.82 876.3,210.82 | 876.3,210.82 1014.1,210.82 | 1014.1,210.82 1033.78,210.82 CMP19.P$1 | CMP13.P$3 1014.1,210.82 | CMP20.P$1 876.3,210.82
STATE_6
  Top 0.61: CMP34.P$4 901.7,228.6 911.23,228.6 | 911.23,228.6 998.86,228.6 CMP13.P$7 | CMP34.P$3 911.23,228.6
STATE_7
  Top 0.61: CMP21.P$2 121.92,213.36 995.04,213.36 CMP13.P$8
STATE_15
  Top 0.61: CMP33.P$1 310.51,233.68 720.09,233.68 720.09,113.03 964.57,113.03 CMP13.P$16
TAKE_EXCEPTION
  Top 0.61: CMP81.P$13 669.29,287.02 805.82,287.02 CMP40.OUT_P
TAKE_INTERRUPT
  Top 0.61: CMP40.P$2 812.8,173.99 380.37,173.99 CMP57.P$7
TRAP_STATE_7
  Top 0.61: CMP57.P$6 384.18,250.19 491.49,250.19 CMP85.P$16
UNSIGNED_15
  Top 0.61: CMP85.P$8 461.01,287.02 272.42,287.02 CMP65.OUT_P
VECTOR_CODE_0
  Top 0.61: CMP58.P$13 773.43,309.88 1088.39,309.88 CMP44.OUT_P
VECTOR_CODE_1
  Top 0.61: CMP58.P$14 777.24,312.42 1136.02,312.42 CMP45.OUT_P
WILL_BE_1__LDI
  Top 0.61: CMP83.P$8 382.9,309.88 35.56,309.88 CMP66.OUT_P
WILL_BE_6__SET_A
  Top 0.61: CMP32.OUT_P CMP33.P$2
WILL_BE_STATE_6
  Top 0.61: CMP85.P$13 480.06,284.48 | 480.06,284.48 302.26,284.48 CMP33.OUT_P | 480.06,284.48 646.43,284.48 CMP81.P$7
WILL_BE_STATE_7
  Top 0.61: CMP85.P$14 483.87,297.18 635,297.18 | 635,297.18 CMP81.P$4 | 635,297.18 908.68,297.18 CMP34.OUT_P
(copper drawn outside any net)
  shapes: Top circle x55

### Text on the board
tPlace: special / _decode(1) | state / _decode(0) | state / _decode(1) | special / _decode(0) | state / _decode(2) | Decoding (A) | div_by_zero | is_end | opcode_is_shift_xx | opcode_is_bit_xx | opcode_is_jmp_abs] | opcode_is_absolute_group | opcode_is_jsr_abs | will_be_1__ldi | opcode_is_stack_rel_group | branch_taken | opcode_is_add_sp | shift_is_shifting | ldi_x_state_0_byte_1_word | opcode_is_add_sp_state_2 | opcode_is_jsr_x_state_7 | h_count_is_15 | reset_flag | opcode_is_jmp_r0 | branch_not_taken | opcode_is_andi_ori_ps | opcode_is_mover_sp | end_of_shift | opcode_is_branch_group | unsigned_15 | dir_sz_is_load_word | start_transfer_cycle | opcode_is_ret | dir_sz_is_load_byte | will_be_6 | will_be_7 | opcode_is_reti | trap_state_7 | opcode_is_push_ra | size_bit_is_byte | opcode_is_indirect_postinc | will_be_7 | opcode_is_jsr_r0 | opcode_is_jsr_abs | opcode_is_trap | opcode_is_shift_bit | opcode_is_stack_rel_group | opcode_is_absolute_group | take_exception | opcode_is_pop_ra_ps | opcode_is_stack_rel_state_2 | opcode_is_shift_xx | will_be_6 | opcode_is_push_ps | opcode_is_sqrt | opcode_is_div_state_0 | type_bit_issigned | opcode_is_mul | opcode_is_trap | opcode_is_stack_group | opcode_is_move_sp_r0 | flag_F2_n | opcode_is_jsr_x_state_7 | opcode_is_jmp_r0 | opcode_is_bxx | opcode_is_add_sp | opcode_is_andi_ori_ps_ldi_x | is_end | opcode_is_jmp_abs | opcode_is_ret_reti | opcode_is_bxx_state_2 | vector_code_0 | vector_code_1 | opcode_is_mul_sqrt_div | 0 | Here we continue the process of working out what needs to be done for / various modules depending on the instruction being executed and the state / we're in. (A) targets the state mchine and the special registers. / The work done here is as much routing as calculation. | Gather signals for controller / of state machine | is_not_interrupting_end | Gather signals for / controller of / special registers | 1 | RESET | Decode instr 2:3 to determine / data transfer size and direction. | not used | state_15 | state_7 | state_6 | state_2 | state_1 | state_0 | flag_F5 | flag_F4 | flag_F2 | match_n | match | instr_3 | instr_2 | instr_0 | is_not_interrupting_end | is_simple_data_transfer | is_end | opcode_is_jsr_x | ldi_x_state_0_bye_1_word | take_interrupt | trap_state_7 | shift_is_shifting | h_count_is_15 | shift_val_non_zero_n | opcode_is_pop_ps | opcode_is_ret | opcode_is_reti | opcode_is_push_ps | opcode_is_trap | opcode_is_jsr_r0 | opcode_is_shift_bit | opcode_is_bit_xx | opcode_is_shift_xx | opcode_is_ldi_x | opcode_is_stack_rel_group | opcode_is_absolute_group | opcode_is_branch_group | opcode_is_indirect_postinc | opcode_is_move_r0_sp | opcode_is_move_sp_r0 | opcode_is_jmp_r0 | opcode_is_jmp_abs | opcode_is_andi_ps | opcode_is_ori_ps | opcode_is_add_sp | opcode_is_sqrt | opcode_is_mul | opcode_is_div | opcode_is_push_ra | opcode_is_pop_ra | div_by_zero | opcode_is_mul_sqrt_div | instr_2_n | instr_0_n | opcode_is_jsr_abs | opcode_is_stack_group | PS | instr | state | decode / _alu_AB | match | decode / _stack / _immediate / _AB | decode / _group_AB | decode / _shared_AB | decode / _misc_AB